# EAGLE design Memory V1.3 (EAGLE 9.7.0)

## Sheet 1 of 6: BUS
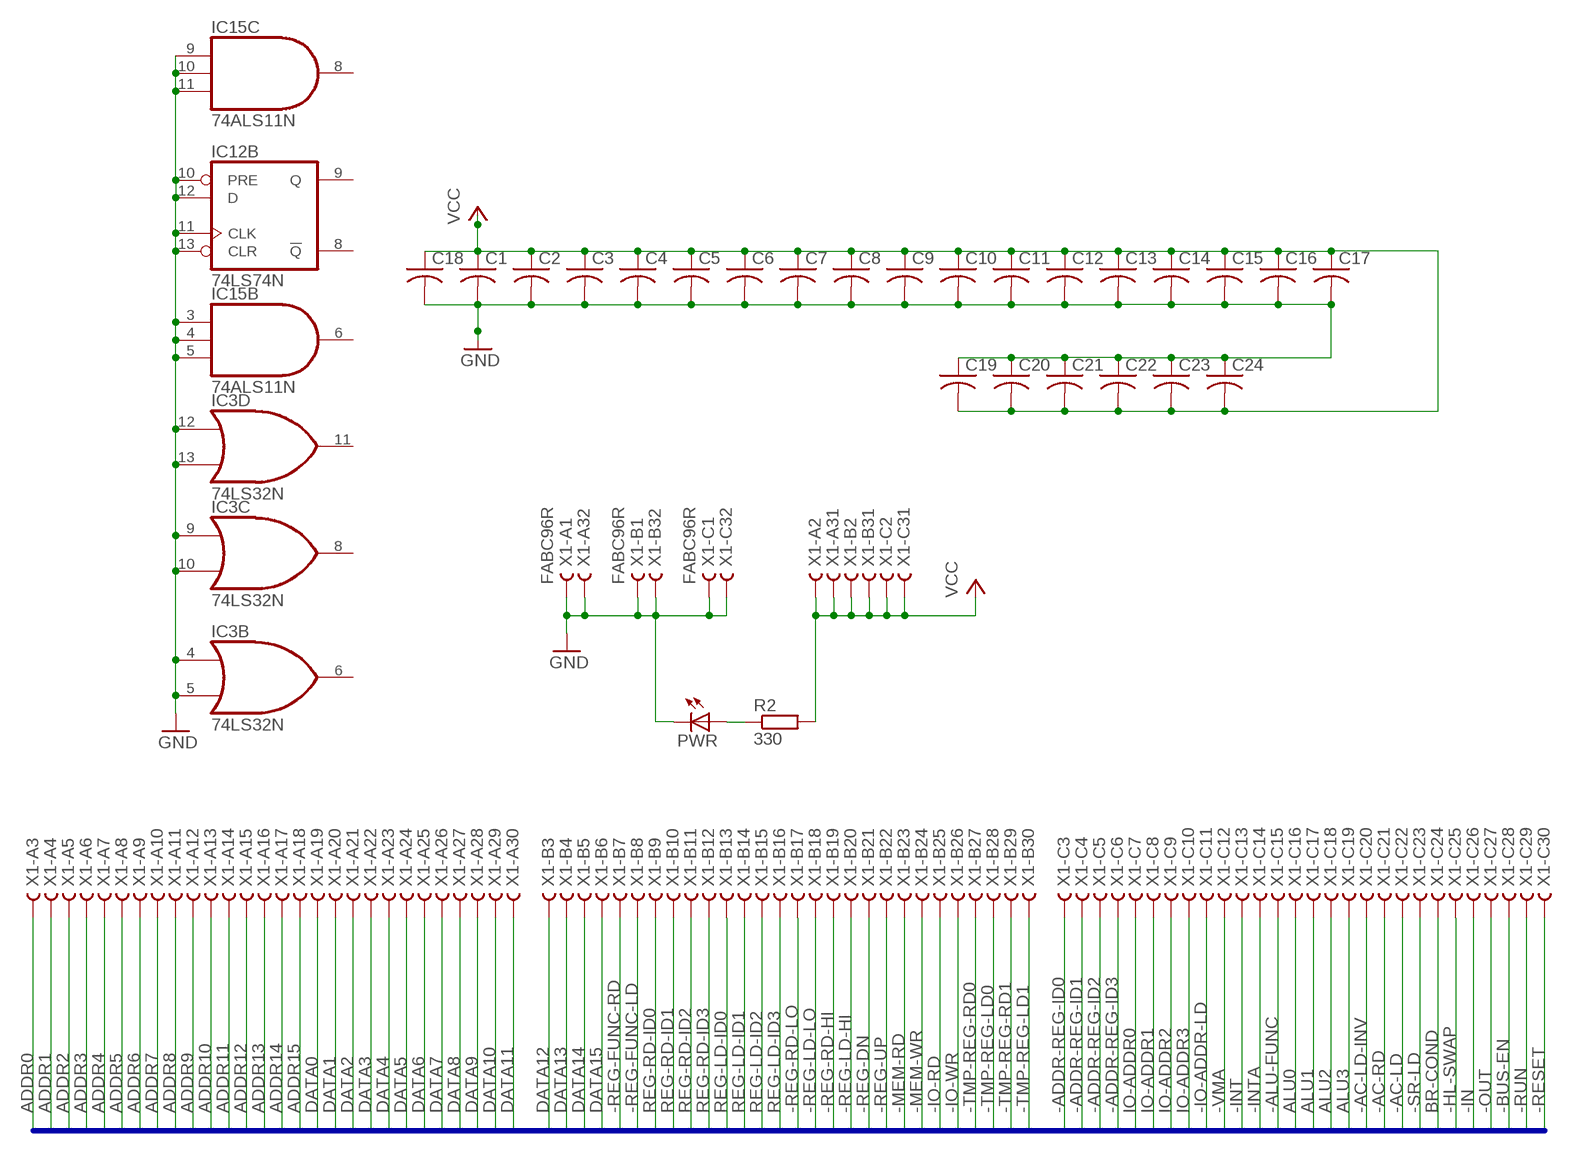
[diagram p0: schematic, sheet 1]

### Parts
C1  C-US025-025X050  [C025-025X050]
C2  C-US025-025X050  [C025-025X050]
C3  C-US025-025X050  [C025-025X050]
C4  C-US025-025X050  [C025-025X050]
C5  C-US025-025X050  [C025-025X050]
C6  C-US025-025X050  [C025-025X050]
C7  C-US025-025X050  [C025-025X050]
C8  C-US025-025X050  [C025-025X050]
C9  C-US025-025X050  [C025-025X050]
C10  C-US025-025X050  [C025-025X050]
C11  C-US025-025X050  [C025-025X050]
C12  C-US025-025X050  [C025-025X050]
C13  C-US025-025X050  [C025-025X050]
C14  C-US025-025X050  [C025-025X050]
C15  C-US025-025X050  [C025-025X050]
C16  C-US025-025X050  [C025-025X050]
C17  C-US025-025X050  [C025-025X050]
C18  C-US025-025X050  [C025-025X050]
C19  C-US025-025X050  [C025-025X050]
C20  C-US025-025X050  [C025-025X050]
C21  C-US025-025X050  [C025-025X050]
C22  C-US025-025X050  [C025-025X050]
C23  C-US025-025X050  [C025-025X050]
C24  C-US025-025X050  [C025-025X050]
IC3  74LS32N  [DIL14]
IC12  74LS74N  [DIL14]
IC15  74ALS11N  [DIL14]
PWR  LED5MM  [LED5MM]
R2  330  R0207/10  [0207/10]
X1  FABC96R  [FABC96R]

### Nets
-AC-LD: X1.C22
-AC-LD-INV: X1.C20
-AC-RD: X1.C21
-ADDR-REG-ID0: X1.C3
-ADDR-REG-ID1: X1.C4
-ADDR-REG-ID2: X1.C5
-ADDR-REG-ID3: X1.C6
-ALU-FUNC: X1.C15
-BUS-EN: X1.C28 ; also sheet 2
-HL-SWAP: X1.C25
-IN: X1.C26
-INT: X1.C13
-INTA: X1.C14
-IO-ADDR-LD: X1.C11
-IO-RD: X1.B25
-IO-WR: X1.B26
-MEM-RD: X1.B23 ; also sheet 3,5
-MEM-WR: X1.B24 ; also sheet 3
-OUT: X1.C27
-REG-DN: X1.B21
-REG-FUNC-LD: X1.B8
-REG-FUNC-RD: X1.B7
-REG-LD-HI: X1.B20
-REG-LD-LO: X1.B18
-REG-RD-HI: X1.B19
-REG-RD-LO: X1.B17
-REG-UP: X1.B22
-RESET: X1.C30 ; also sheet 2
-RUN: X1.C29
-SR-LD: X1.C23
-TMP-REG-LD0: X1.B28 ; also sheet 6
-TMP-REG-LD1: X1.B30 ; also sheet 6
-TMP-REG-RD0: X1.B27 ; also sheet 6
-TMP-REG-RD1: X1.B29 ; also sheet 6
-VMA: X1.C12 ; also sheet 2,3
ADDR0: X1.A3 ; also sheet 4
ADDR1: X1.A4 ; also sheet 4
ADDR2: X1.A5 ; also sheet 4
ADDR3: X1.A6 ; also sheet 4
ADDR4: X1.A7 ; also sheet 4
ADDR5: X1.A8 ; also sheet 4
ADDR6: X1.A9 ; also sheet 4
ADDR7: X1.A10 ; also sheet 4
ADDR8: X1.A11 ; also sheet 4
ADDR9: X1.A12 ; also sheet 4
ADDR10: X1.A13 ; also sheet 4
ADDR11: X1.A14 ; also sheet 4
ADDR12: X1.A15 ; also sheet 4
ADDR13: X1.A16 ; also sheet 4
ADDR14: X1.A17 ; also sheet 4
ADDR15: X1.A18 ; also sheet 2,4
ALU0: X1.C16
ALU1: X1.C17
ALU2: X1.C18
ALU3: X1.C19
BR-COND: X1.C24
DATA0: X1.A19 ; also sheet 5,6
DATA1: X1.A20 ; also sheet 5,6
DATA2: X1.A21 ; also sheet 5,6
DATA3: X1.A22 ; also sheet 5,6
DATA4: X1.A23 ; also sheet 5,6
DATA5: X1.A24 ; also sheet 5,6
DATA6: X1.A25 ; also sheet 5,6
DATA7: X1.A26 ; also sheet 5,6
DATA8: X1.A27 ; also sheet 6
DATA9: X1.A28 ; also sheet 6
DATA10: X1.A29 ; also sheet 6
DATA11: X1.A30 ; also sheet 6
DATA12: X1.B3 ; also sheet 6
DATA13: X1.B4 ; also sheet 6
DATA14: X1.B5 ; also sheet 6
DATA15: X1.B6 ; also sheet 6
GND: C1.2 C2.2 C3.2 C4.2 C5.2 C6.2 C7.2 C8.2 C9.2 C10.2 C11.2 C12.2 C13.2 C14.2 C15.2 C16.2 C17.2 C18.2 C19.1 C20.1 C21.1 C22.1 C23.1 C24.1 IC3.4(B:I0) IC3.5(B:I1) IC3.9(C:I0) IC3.10(C:I1) IC3.12(D:I0) IC3.13(D:I1) IC12.10(B:PRE) IC12.11(B:CLK) IC12.12(B:D) IC12.13(B:CLR) IC15.3(B:I0) IC15.4(B:I1) IC15.5(B:I2) IC15.9(C:I0) IC15.10(C:I1) IC15.11(C:I2) PWR.K(C) X1.A1 X1.A32 X1.B1 X1.B32 X1.C1 X1.C32 ; also sheet 2,3,4,6
IO-ADDR0: X1.C7
IO-ADDR1: X1.C8
IO-ADDR2: X1.C9
IO-ADDR3: X1.C10
N$11: PWR.A R2.1
REG-LD-ID0: X1.B13
REG-LD-ID1: X1.B14
REG-LD-ID2: X1.B15
REG-LD-ID3: X1.B16
REG-RD-ID0: X1.B9
REG-RD-ID1: X1.B10
REG-RD-ID2: X1.B11
REG-RD-ID3: X1.B12
VCC: C1.1 C2.1 C3.1 C4.1 C5.1 C6.1 C7.1 C8.1 C9.1 C10.1 C11.1 C12.1 C13.1 C14.1 C15.1 C16.1 C17.1 C18.1 C19.2 C20.2 C21.2 C22.2 C23.2 C24.2 R2.2 X1.A2 X1.A31 X1.B2 X1.B31 X1.C2 X1.C31 ; also sheet 2,3,4
Unconnected: IC3.6(B:O) IC3.8(C:O) IC3.11(D:O) IC12.8(B:!Q) IC12.9(B:Q) IC15.6(B:O) IC15.8(C:O)

### Buses
MAINBUS:-AC-LD,-AC-LD-INV,-AC-RD,ADDR[0..15],-ADDR-REG-LD[0..1],-ADDR-REG-RD[0..1],ALU[0..3],-ALU-FUNC,BR-COND,-BUS-EN,DATA[0..15],-HL-SWAP,-IN,-INT,-INTA,IO-ADDR[0..3],-IO-ADDR-LD,-IO-RD,-IO-WR,-MEM-RD,-MEM-WR,-OUT,-REG-DN,-REG-FUNC-LD,-REG-FUNC-RD,-REG-LD-HI,REG-LD-ID[0..3],-REG-LD-LO,-REG-RD-HI,REG-RD-ID[0..3],-REG-RD-LO,-REG-UP,-RESET,-RUN,-SR-LD,-TMP-REG-LD[0..1],-TMP-REG-RD[0..1],-VMA

## Sheet 2 of 6: Memory Select
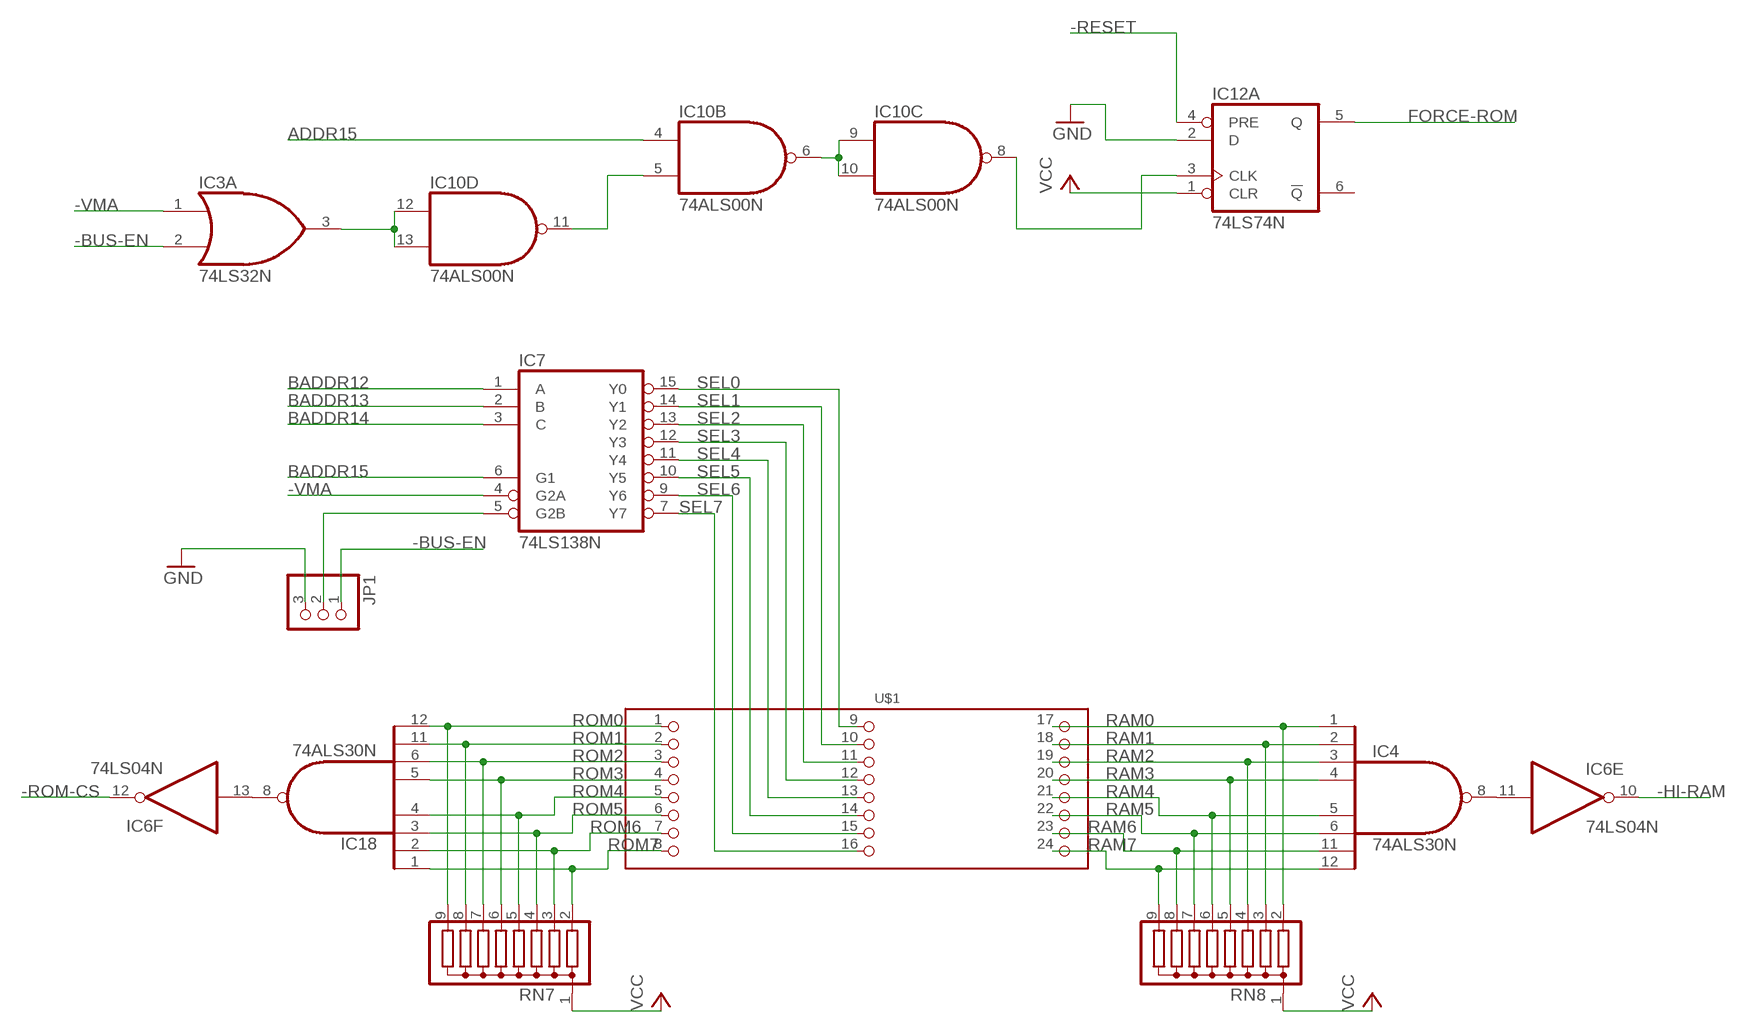
[diagram p1: schematic, sheet 2]

### Parts
IC4  74ALS30N  [DIL14]
IC6  74LS04N  [DIL14]
IC7  74LS138N  [DIL16]
IC10  74ALS00N  [DIL14]
IC18  74ALS30N  [DIL14]
JP1  PINHD-1X3  [1X03]
RN7  G08R  [SIL9]
RN8  G08R  [SIL9]
U$1  PIN_3X8  [PIN_3X8]

### Nets
-BUS-EN: IC3.2(A:I1) JP1.1 ; also sheet 1
-HI-RAM: IC6.10(E:O) ; also sheet 3,5
-RESET: IC12.4(A:PRE) ; also sheet 1
-ROM-CS: IC6.12(F:O) ; also sheet 3,5
-VMA: IC3.1(A:I0) IC7.4(G2A) ; also sheet 1,3
ADDR15: IC10.4(B:I0) ; also sheet 1,4
BADDR12: IC7.1(A) ; also sheet 3,4
BADDR13: IC7.2(B) ; also sheet 3,4
BADDR14: IC7.3(C) ; also sheet 3,4
BADDR15: IC7.6(G1) ; also sheet 3,4
FORCE-ROM: IC12.5(A:Q) ; also sheet 4
GND: IC12.2(A:D) JP1.3 ; also sheet 1,3,4,6
N$1: IC6.13(F:I) IC18.8(O)
N$14: IC4.8(O) IC6.11(E:I)
N$19: IC10.8(C:O) IC12.3(A:CLK)
N$20: IC10.6(B:O) IC10.9(C:I0) IC10.10(C:I1)
N$22: IC10.5(B:I1) IC10.11(D:O)
N$24: IC7.5(G2B) JP1.2
N$25: IC3.3(A:O) IC10.12(D:I0) IC10.13(D:I1)
RAM0: IC4.1(I0) RN8.2 U$1.17
RAM1: IC4.2(I1) RN8.3 U$1.18
RAM2: IC4.3(I2) RN8.4 U$1.19
RAM3: IC4.4(I3) RN8.5 U$1.20
RAM4: IC4.5(I4) RN8.6 U$1.21
RAM5: IC4.6(I5) RN8.7 U$1.22
RAM6: IC4.11(I6) RN8.8 U$1.23
RAM7: IC4.12(I7) RN8.9 U$1.24
ROM0: IC18.12(I7) RN7.9 U$1.1
ROM1: IC18.11(I6) RN7.8 U$1.2
ROM2: IC18.6(I5) RN7.7 U$1.3
ROM3: IC18.5(I4) RN7.6 U$1.4
ROM4: IC18.4(I3) RN7.5 U$1.5
ROM5: IC18.3(I2) RN7.4 U$1.6
ROM6: IC18.2(I1) RN7.3 U$1.7
ROM7: IC18.1(I0) RN7.2 U$1.8
SEL0: IC7.15(Y0) U$1.9
SEL1: IC7.14(Y1) U$1.10
SEL2: IC7.13(Y2) U$1.11
SEL3: IC7.12(Y3) U$1.12
SEL4: IC7.11(Y4) U$1.13
SEL5: IC7.10(Y5) U$1.14
SEL6: IC7.9(Y6) U$1.15
SEL7: IC7.7(Y7) U$1.16
VCC: IC12.1(A:CLR) RN7.1 RN8.1 ; also sheet 1,3,4
Unconnected: IC12.6(A:!Q)

## Sheet 3 of 6: Memory
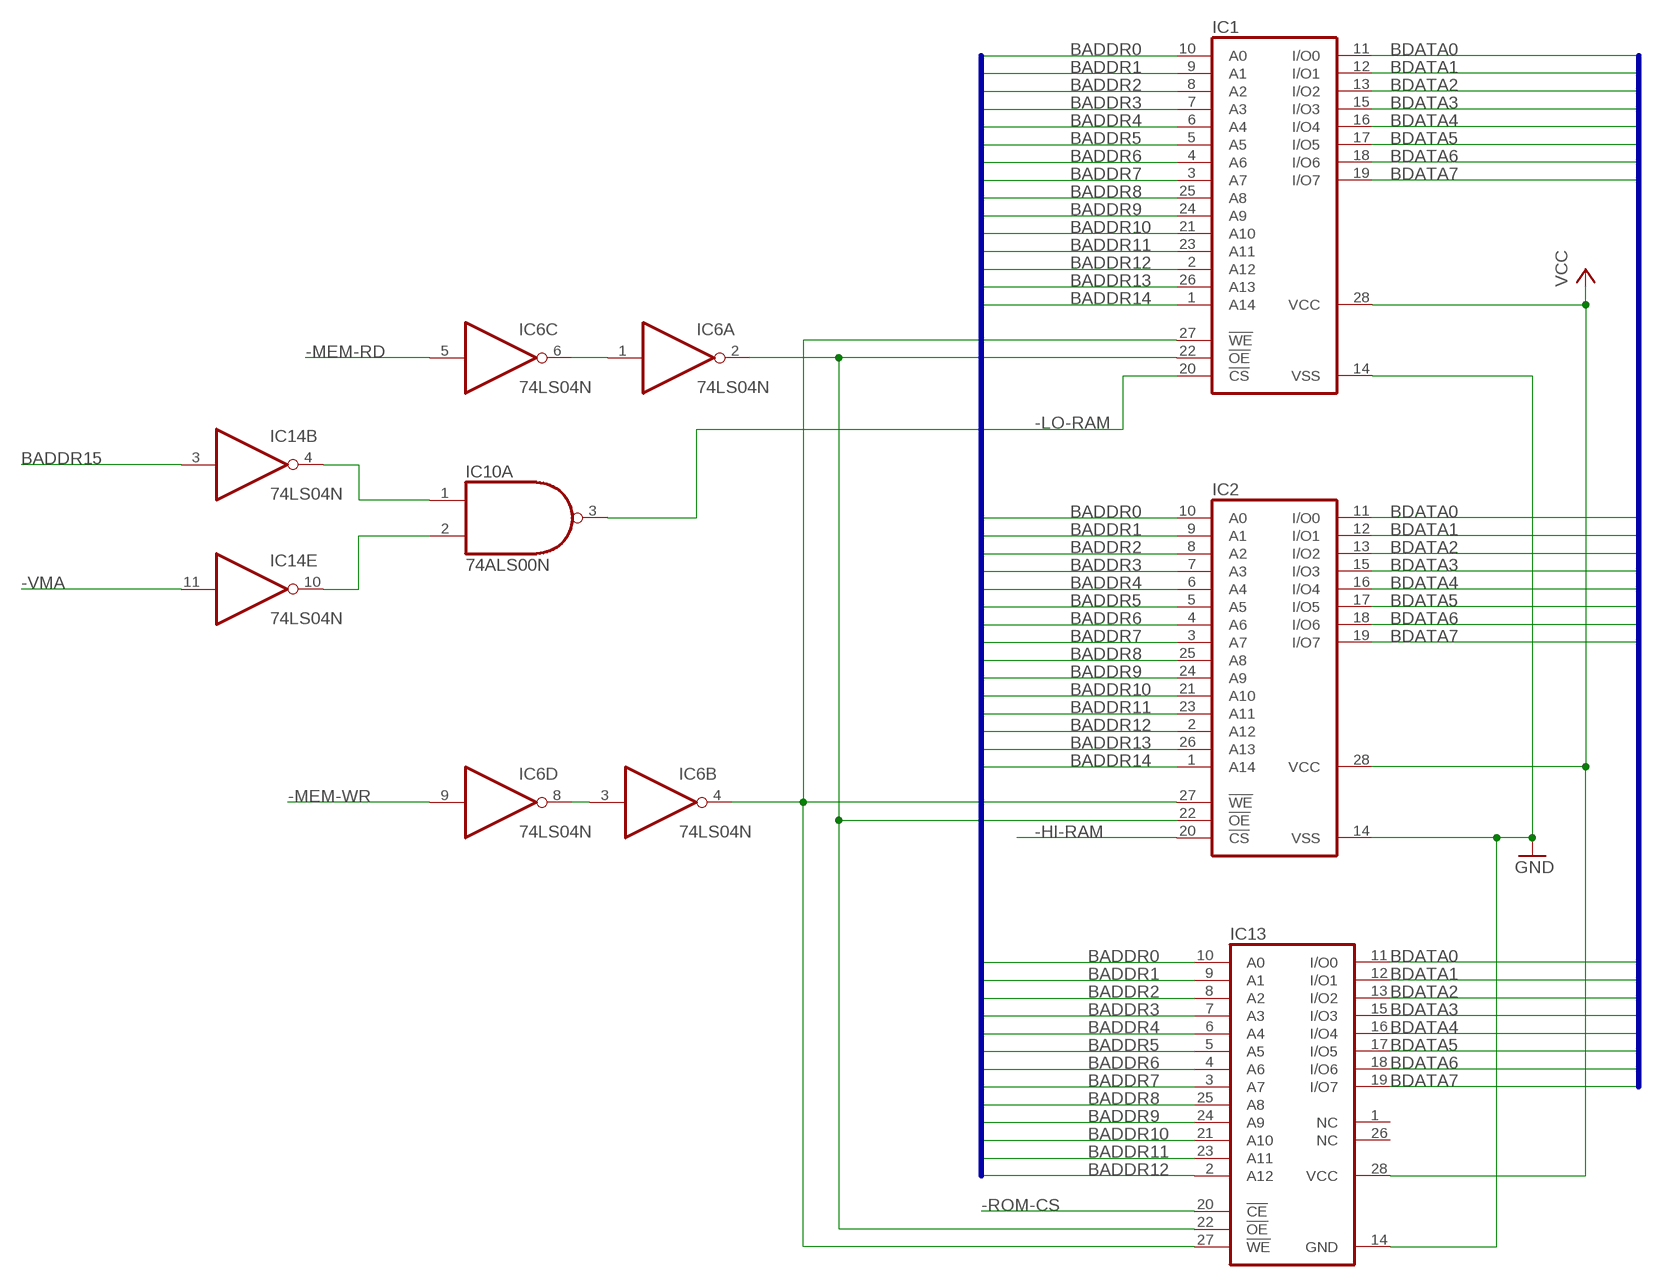
[diagram p2: schematic, sheet 3]

### Parts
IC1  62256P  [DIL28-6]
IC2  62256P  [DIL28-6]
IC13  28C64C  [DIL28-6]
IC14  74LS04N  [DIL14]

### Nets
-HI-RAM: IC2.20(!CS) ; also sheet 2,5
-LO-RAM: IC1.20(!CS) IC10.3(A:O) ; also sheet 5
-MEM-RD: IC6.5(C:I) ; also sheet 1,5
-MEM-WR: IC6.9(D:I) ; also sheet 1
-ROM-CS: IC13.20(!CE) ; also sheet 2,5
-VMA: IC14.11(E:I) ; also sheet 1,2
BADDR0: IC1.10(A0) IC2.10(A0) IC13.10(A0) ; also sheet 4
BADDR1: IC1.9(A1) IC2.9(A1) IC13.9(A1) ; also sheet 4
BADDR2: IC1.8(A2) IC2.8(A2) IC13.8(A2) ; also sheet 4
BADDR3: IC1.7(A3) IC2.7(A3) IC13.7(A3) ; also sheet 4
BADDR4: IC1.6(A4) IC2.6(A4) IC13.6(A4) ; also sheet 4
BADDR5: IC1.5(A5) IC2.5(A5) IC13.5(A5) ; also sheet 4
BADDR6: IC1.4(A6) IC2.4(A6) IC13.4(A6) ; also sheet 4
BADDR7: IC1.3(A7) IC2.3(A7) IC13.3(A7) ; also sheet 4
BADDR8: IC1.25(A8) IC2.25(A8) IC13.25(A8) ; also sheet 4
BADDR9: IC1.24(A9) IC2.24(A9) IC13.24(A9) ; also sheet 4
BADDR10: IC1.21(A10) IC2.21(A10) IC13.21(A10) ; also sheet 4
BADDR11: IC1.23(A11) IC2.23(A11) IC13.23(A11) ; also sheet 4
BADDR12: IC1.2(A12) IC2.2(A12) IC13.2(A12) ; also sheet 2,4
BADDR13: IC1.26(A13) IC2.26(A13) ; also sheet 2,4
BADDR14: IC1.1(A14) IC2.1(A14) ; also sheet 2,4
BADDR15: IC14.3(B:I) ; also sheet 2,4
BDATA0: IC1.11(I/O0) IC2.11(I/O0) IC13.11(I/O0) ; also sheet 5
BDATA1: IC1.12(I/O1) IC2.12(I/O1) IC13.12(I/O1) ; also sheet 5
BDATA2: IC1.13(I/O2) IC2.13(I/O2) IC13.13(I/O2) ; also sheet 5
BDATA3: IC1.15(I/O3) IC2.15(I/O3) IC13.15(I/O3) ; also sheet 5
BDATA4: IC1.16(I/O4) IC2.16(I/O4) IC13.16(I/O4) ; also sheet 5
BDATA5: IC1.17(I/O5) IC2.17(I/O5) IC13.17(I/O5) ; also sheet 5
BDATA6: IC1.18(I/O6) IC2.18(I/O6) IC13.18(I/O6) ; also sheet 5
BDATA7: IC1.19(I/O7) IC2.19(I/O7) IC13.19(I/O7) ; also sheet 5
GND: IC1.14(VSS) IC2.14(VSS) IC13.14(GND) ; also sheet 1,2,4,6
MEM-RD: IC6.1(A:I) IC6.6(C:O)
N$2: IC6.3(B:I) IC6.8(D:O)
N$3: IC1.22(!OE) IC2.22(!OE) IC6.2(A:O) IC13.22(!OE)
N$4: IC1.27(!WE) IC2.27(!WE) IC6.4(B:O) IC13.27(!WE)
N$12: IC10.2(A:I1) IC14.10(E:O)
N$13: IC10.1(A:I0) IC14.4(B:O)
VCC: IC1.28(VCC) IC2.28(VCC) IC13.28(VCC) ; also sheet 1,2,4
Unconnected: IC13.1(NC) IC13.26(NC) IC14.5(C:I) IC14.6(C:O) IC14.8(D:O) IC14.9(D:I)

### Buses
BADDR[0..15]
BDATA[0..7]

## Sheet 4 of 6: Adress Buffering
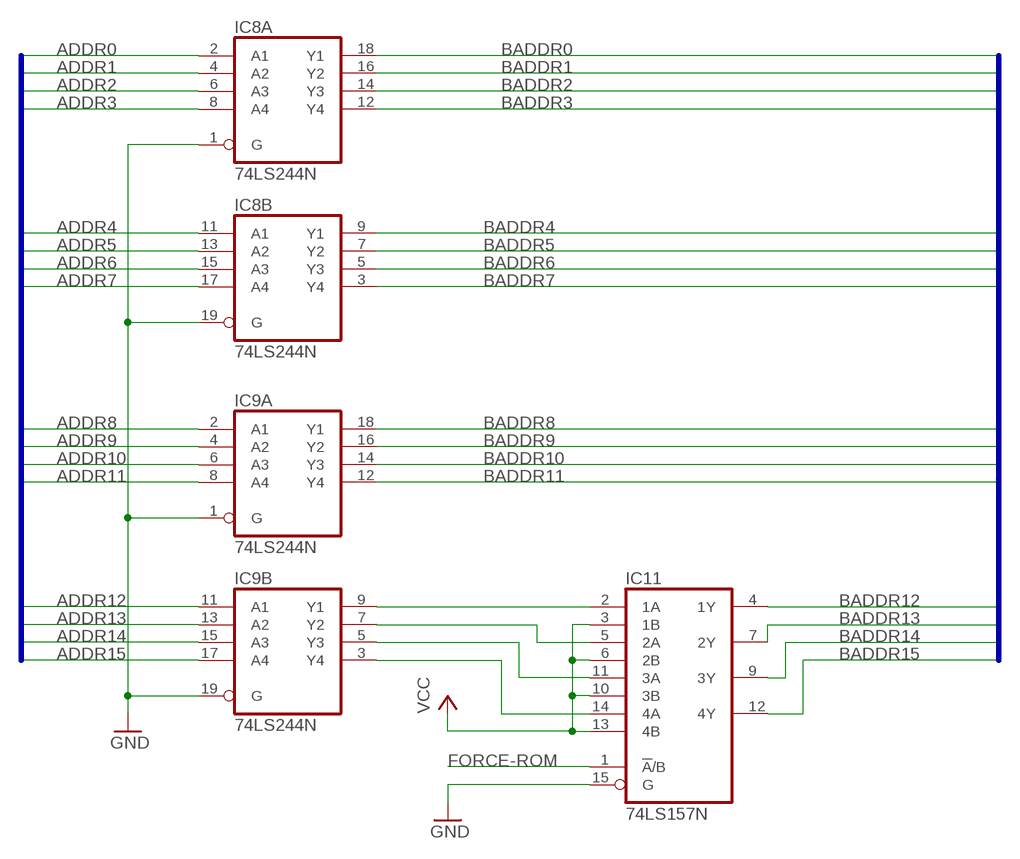
[diagram p3: schematic, sheet 4]

### Parts
IC8  74LS244N  [DIL20]
IC9  74LS244N  [DIL20]
IC11  74LS157N  [DIL16]

### Nets
ADDR0: IC8.2(A:A1) ; also sheet 1
ADDR1: IC8.4(A:A2) ; also sheet 1
ADDR2: IC8.6(A:A3) ; also sheet 1
ADDR3: IC8.8(A:A4) ; also sheet 1
ADDR4: IC8.11(B:A1) ; also sheet 1
ADDR5: IC8.13(B:A2) ; also sheet 1
ADDR6: IC8.15(B:A3) ; also sheet 1
ADDR7: IC8.17(B:A4) ; also sheet 1
ADDR8: IC9.2(A:A1) ; also sheet 1
ADDR9: IC9.4(A:A2) ; also sheet 1
ADDR10: IC9.6(A:A3) ; also sheet 1
ADDR11: IC9.8(A:A4) ; also sheet 1
ADDR12: IC9.11(B:A1) ; also sheet 1
ADDR13: IC9.13(B:A2) ; also sheet 1
ADDR14: IC9.15(B:A3) ; also sheet 1
ADDR15: IC9.17(B:A4) ; also sheet 1,2
BADDR0: IC8.18(A:Y1) ; also sheet 3
BADDR1: IC8.16(A:Y2) ; also sheet 3
BADDR2: IC8.14(A:Y3) ; also sheet 3
BADDR3: IC8.12(A:Y4) ; also sheet 3
BADDR4: IC8.9(B:Y1) ; also sheet 3
BADDR5: IC8.7(B:Y2) ; also sheet 3
BADDR6: IC8.5(B:Y3) ; also sheet 3
BADDR7: IC8.3(B:Y4) ; also sheet 3
BADDR8: IC9.18(A:Y1) ; also sheet 3
BADDR9: IC9.16(A:Y2) ; also sheet 3
BADDR10: IC9.14(A:Y3) ; also sheet 3
BADDR11: IC9.12(A:Y4) ; also sheet 3
BADDR12: IC11.4(1Y) ; also sheet 2,3
BADDR13: IC11.7(2Y) ; also sheet 2,3
BADDR14: IC11.9(3Y) ; also sheet 2,3
BADDR15: IC11.12(4Y) ; also sheet 2,3
FORCE-ROM: IC11.1(!A!/B) ; also sheet 2
GND: IC8.1(A:G) IC8.19(B:G) IC9.1(A:G) IC9.19(B:G) IC11.15(G) ; also sheet 1,2,3,6
N$15: IC9.9(B:Y1) IC11.2(1A)
N$16: IC9.7(B:Y2) IC11.5(2A)
N$17: IC9.5(B:Y3) IC11.11(3A)
N$18: IC9.3(B:Y4) IC11.14(4A)
VCC: IC11.3(1B) IC11.6(2B) IC11.10(3B) IC11.13(4B) ; also sheet 1,2,3

### Buses
ADDR0,ADDR1,ADDR2,ADDR3,ADDR4,ADDR5,ADDR6,ADDR7,ADDR8,ADDR9,ADDR10,ADDR11,ADDR12,ADDR13,ADDR14,ADDR15
BADDR[0..15]

## Sheet 5 of 6: Data Buffer
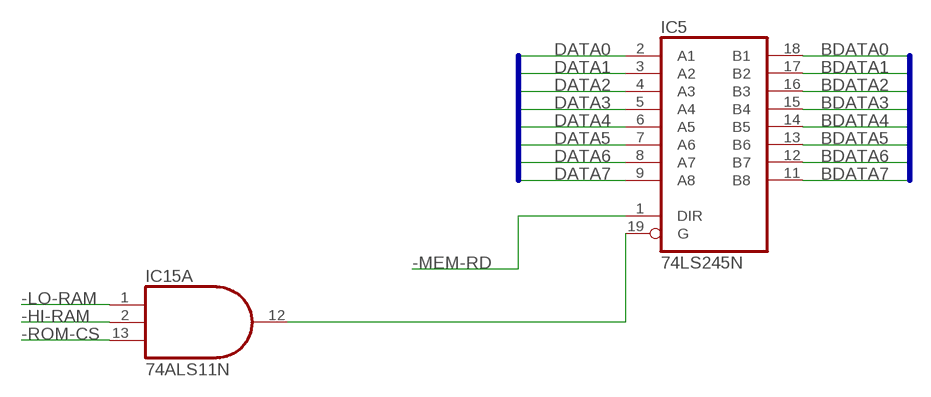
[diagram p4: schematic, sheet 5]

### Parts
IC5  74LS245N  [DIL20]

### Nets
-HI-RAM: IC15.2(A:I1) ; also sheet 2,3
-LO-RAM: IC15.1(A:I0) ; also sheet 3
-MEM-RD: IC5.1(DIR) ; also sheet 1,3
-ROM-CS: IC15.13(A:I2) ; also sheet 2,3
BDATA0: IC5.18(B1) ; also sheet 3
BDATA1: IC5.17(B2) ; also sheet 3
BDATA2: IC5.16(B3) ; also sheet 3
BDATA3: IC5.15(B4) ; also sheet 3
BDATA4: IC5.14(B5) ; also sheet 3
BDATA5: IC5.13(B6) ; also sheet 3
BDATA6: IC5.12(B7) ; also sheet 3
BDATA7: IC5.11(B8) ; also sheet 3
DATA0: IC5.2(A1) ; also sheet 1,6
DATA1: IC5.3(A2) ; also sheet 1,6
DATA2: IC5.4(A3) ; also sheet 1,6
DATA3: IC5.5(A4) ; also sheet 1,6
DATA4: IC5.6(A5) ; also sheet 1,6
DATA5: IC5.7(A6) ; also sheet 1,6
DATA6: IC5.8(A7) ; also sheet 1,6
DATA7: IC5.9(A8) ; also sheet 1,6
N$21: IC5.19(G) IC15.12(A:O)

### Buses
DATA[0..7]
BDATA0,BDATA1,BDATA2,BDATA3,BDATA4,BDATA5,BDATA6,BDATA7

## Sheet 6 of 6
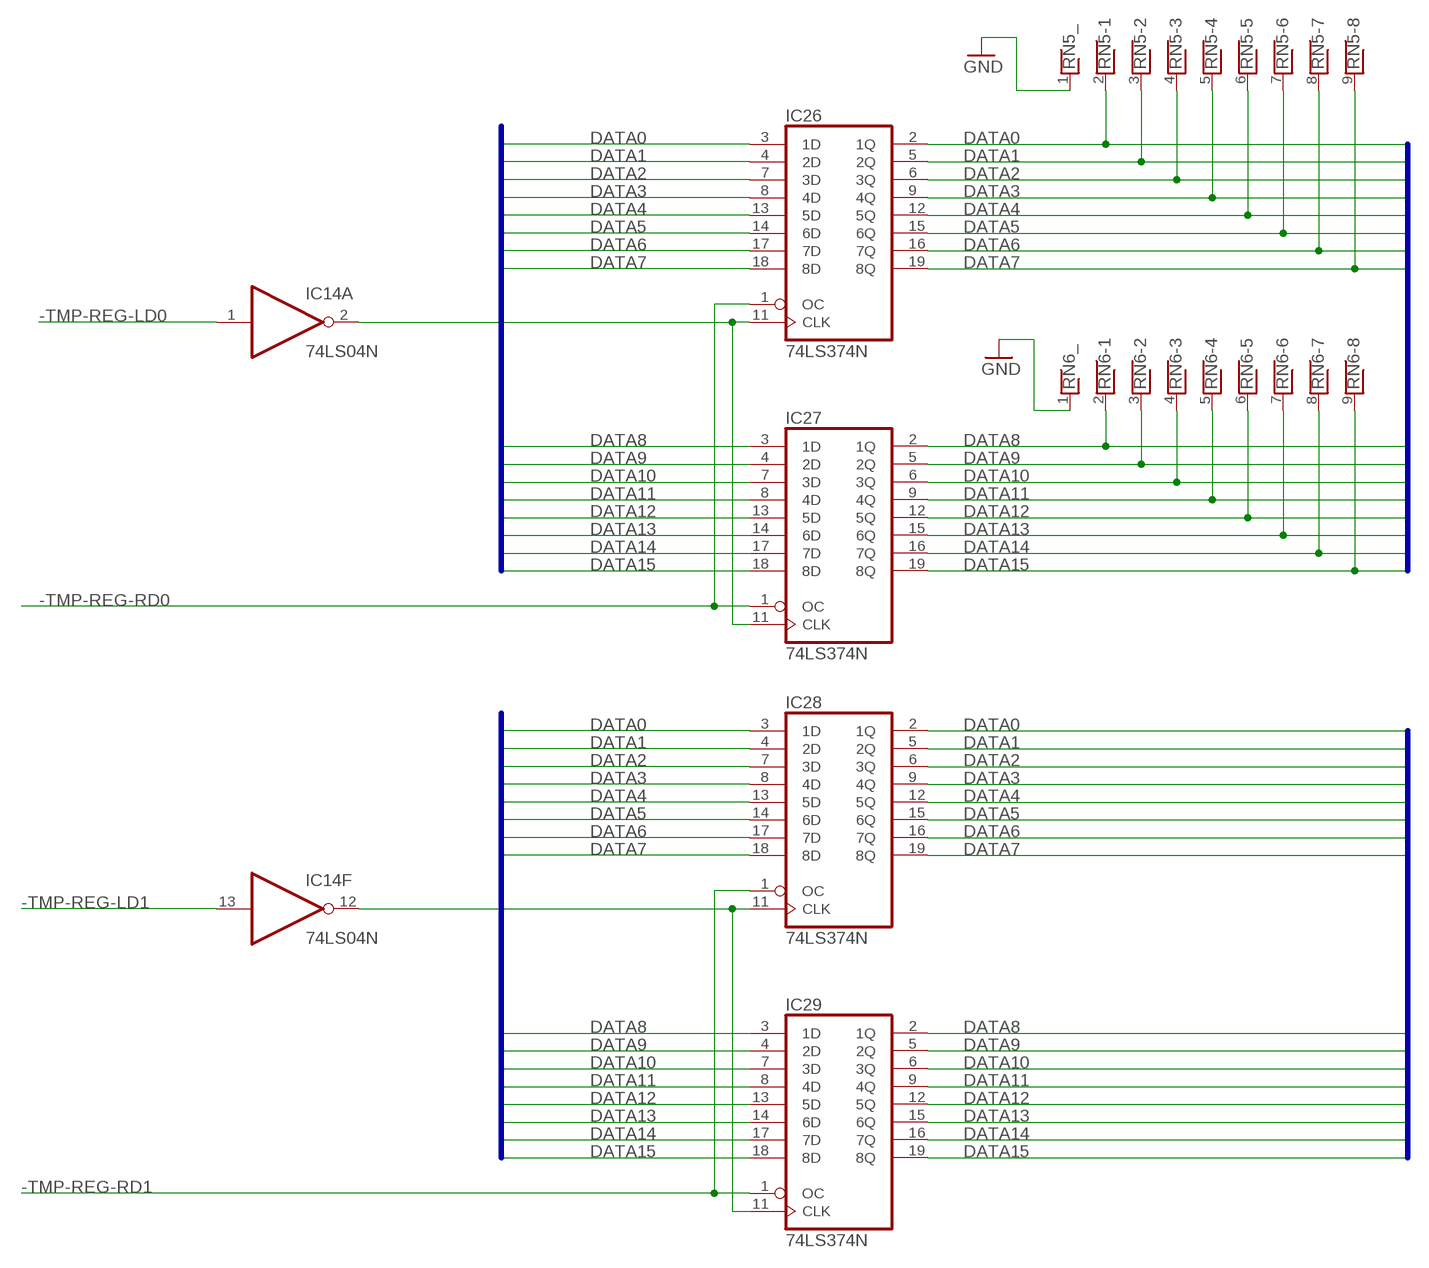
[diagram p5: schematic, sheet 6]

### Parts
IC26  74LS374N  [DIL20]
IC27  74LS374N  [DIL20]
IC28  74LS374N  [DIL20]
IC29  74LS374N  [DIL20]
RN5  RNX8  [RN-9]
RN6  RNX8  [RN-9]

### Nets
-TMP-REG-LD0: IC14.1(A:I) ; also sheet 1
-TMP-REG-LD1: IC14.13(F:I) ; also sheet 1
-TMP-REG-RD0: IC26.1(OC) IC27.1(OC) ; also sheet 1
-TMP-REG-RD1: IC28.1(OC) IC29.1(OC) ; also sheet 1
DATA0: IC26.2(1Q) IC26.3(1D) IC28.2(1Q) IC28.3(1D) RN5.2 ; also sheet 1,5
DATA1: IC26.4(2D) IC26.5(2Q) IC28.4(2D) IC28.5(2Q) RN5.3 ; also sheet 1,5
DATA2: IC26.6(3Q) IC26.7(3D) IC28.6(3Q) IC28.7(3D) RN5.4 ; also sheet 1,5
DATA3: IC26.8(4D) IC26.9(4Q) IC28.8(4D) IC28.9(4Q) RN5.5 ; also sheet 1,5
DATA4: IC26.12(5Q) IC26.13(5D) IC28.12(5Q) IC28.13(5D) RN5.6 ; also sheet 1,5
DATA5: IC26.14(6D) IC26.15(6Q) IC28.14(6D) IC28.15(6Q) RN5.7 ; also sheet 1,5
DATA6: IC26.16(7Q) IC26.17(7D) IC28.16(7Q) IC28.17(7D) RN5.8 ; also sheet 1,5
DATA7: IC26.18(8D) IC26.19(8Q) IC28.18(8D) IC28.19(8Q) RN5.9 ; also sheet 1,5
DATA8: IC27.2(1Q) IC27.3(1D) IC29.2(1Q) IC29.3(1D) RN6.2 ; also sheet 1
DATA9: IC27.4(2D) IC27.5(2Q) IC29.4(2D) IC29.5(2Q) RN6.3 ; also sheet 1
DATA10: IC27.6(3Q) IC27.7(3D) IC29.6(3Q) IC29.7(3D) RN6.4 ; also sheet 1
DATA11: IC27.8(4D) IC27.9(4Q) IC29.8(4D) IC29.9(4Q) RN6.5 ; also sheet 1
DATA12: IC27.12(5Q) IC27.13(5D) IC29.12(5Q) IC29.13(5D) RN6.6 ; also sheet 1
DATA13: IC27.14(6D) IC27.15(6Q) IC29.14(6D) IC29.15(6Q) RN6.7 ; also sheet 1
DATA14: IC27.16(7Q) IC27.17(7D) IC29.16(7Q) IC29.17(7D) RN6.8 ; also sheet 1
DATA15: IC27.18(8D) IC27.19(8Q) IC29.18(8D) IC29.19(8Q) RN6.9 ; also sheet 1
GND: RN5.1 RN6.1 ; also sheet 1,2,3,4
N$33: IC14.2(A:O) IC26.11(CLK) IC27.11(CLK)
N$47: IC14.12(F:O) IC28.11(CLK) IC29.11(CLK)

### Buses
DATABUS:DATA[0..15]

## Power pins joined to a net without a drawn wire
GND: IC3.7(P:GND) IC4.7(GND) IC5.10(GND) IC6.7(P:GND) IC7.8(GND) IC8.10(P:GND) IC9.10(P:GND) IC10.7(P:GND) IC11.8(GND) IC12.7(P:GND) IC14.7(P:GND) IC15.7(P:GND) IC18.7(GND) IC26.10(GND) IC27.10(GND) IC28.10(GND) IC29.10(GND)
VCC: IC3.14(P:VCC) IC4.14(VCC) IC5.20(VCC) IC6.14(P:VCC) IC7.16(VCC) IC8.20(P:VCC) IC9.20(P:VCC) IC10.14(P:VCC) IC11.16(VCC) IC12.14(P:VCC) IC14.14(P:VCC) IC15.14(P:VCC) IC18.14(VCC) IC26.20(VCC) IC27.20(VCC) IC28.20(VCC) IC29.20(VCC)

## Library data of the parts
C1-C24 = adafruit:C-US: CAPACITOR, American symbol
IC1 IC2 = memory-hitachi:62256P: MEMORY; OC_FARNELL: unknown; OC_NEWARK: unknown
IC3 = 74xx-us:74*32: Quad 2-input OR gate
IC4 IC18 = 74xx-us:74*30: 8-input NAND gate
IC5 = adafruit:74*245: Octal BUS TRANSCEIVER, 3-state
IC6 IC14 = 74xx-us:74*04: Hex INVERTER
IC7 = 74xx-us:74*138: 3-line to 8-line DECODER/DEMULTIPLEXER
IC8 IC9 = 74xx-us:74*244: Octal BUFFER and LINE DRIVER, 3-state
IC10 = 74xx-us:74*00: Quad 2-input NAND gate
IC11 = 74xx-us:74*157: Quadruple 2-line to 1-line data SELECTOR/MULTIPLEXER
IC12 = 74xx-us:74*74: Dual D type positive edge triggered FLIP FLOP, preset and clear
IC13 = memory-nec:28C64C: MEMORY; MPN: AT28C64B-15PU; OC_FARNELL: 1095784; OC_NEWARK: 96K6557
IC15 = 74xx-us:74*11: Triple 3-input AND gate
IC26-IC29 = 74xx-us:74*374: Octal D type transparent LATCH, edge triggered
JP1 = pinhead:PINHD-1X3: PIN HEADER
PWR = led:LED: LED OSRAM: - CHIPLED LG R971, LG N971, LY N971, LG Q971, LY Q971, LO R971, LY R971 LH N974, LH R974 LS Q976, LO Q976, LY Q976 LO Q996 - Hyper CHIPLED LW Q18S LB Q993, LB Q99A, LB R99A - SideLED LS A670, LO A670, LY A670, LG A670, LP A670 LB A673, LV A673, LT A673, LW A673 LH A674 LY A675 LS A676, LA A676, LO A676, LY A676, LW A676 LS A679, LY A679, LG A679 - Hyper Micro SIDELED® LS Y876, LA Y876, LO Y876, LY Y876 LT Y87S - SmartLED LW L88C, LW L88S LB L89C, LB L89S, LG L890 LS L89K, LO L89K, LY L89K LS L896, LA L896, LO L896, LY L896 - TOPLED LS T670, LO T670, LY T670, LG T670, LP T670 LSG T670, LSP T670, LSY T670, LOP T670, LYG T670 LG T671, LOG T671, LSG T671 LB T673, LV T673, LT T673, LW T673 LH T674 LS T676, LA T676, LO T676, LY T676, LB T676, LH T676, LSB T676, LW T676 LB T67C, LV T67C, LT T67C, LS T67K, LO T67K, LY T67K, LW E67C LS E67B, LA E67B, LO E67B, LY E67B, LB E67C, LV E67C, LT E67C LW T67C LS T679, LY T679, LG T679 LS T770, LO T770, LY T770, LG T770, LP T770 LB T773, LV T773, LT T773, LW T773 LH T774 LS E675, LA E675, LY E675, LS T675 LS T776, LA T776, LO T776, LY T776, LB T776 LHGB T686 LT T68C, LB T68C - Hyper Mini TOPLED® LB M676 - Mini TOPLED Santana® LG M470 LS M47K, LO M47K, LY M47K Source: http://www.osram.convergy.de LUXEON: - LUMILED® LXK2-PW12-R00, LXK2-PW12-S00, LXK2-PW14-U00, LXK2-PW14-V00 LXK2-PM12-R00, LXK2-PM12-S00, LXK2-PM14-U00 LXK2-PE12-Q00, LXK2-PE12-R00, LXK2-PE12-S00, LXK2-PE14-T00, LXK2-PE14-U00 LXK2-PB12-K00, LXK2-PB12-L00, LXK2-PB12-M00, LXK2-PB14-N00, LXK2-PB14-P00, LXK2-PB14-Q00 LXK2-PR12-L00, LXK2-PR12-M00, LXK2-PR14-Q00, LXK2-PR14-R00 LXK2-PD12-Q00, LXK2-PD12-R00, LXK2-PD12-S00 LXK2-PH12-R00, LXK2-PH12-S00 LXK2-PL12-P00, LXK2-PL12-Q00, LXK2-PL12-R00 Source: www.luxeon.com KINGBRIGHT: KA-3528ASYC Source: www.kingbright.com
R2 = eagle-ltspice:R: RESISTOR, European symbol; SPICEMODEL: NONE; SPICEPREFIX: R
RN5 RN6 = resistor-net:RNX8: RESISTOR NETWORK; OC_FARNELL: unknown; OC_NEWARK: unknown
RN7 RN8 = resistor-sil:G08R: SIL RESISTOR; OC_FARNELL: unknown; OC_NEWARK: unknown
U$1 = pinhead_3row:PIN_3X8
X1 = con-vg:FABC96R: CONNECTOR female, 96 pins, type R, rows ABC, grid 2.54 mm

## Net classes
1 GND: width 1 mm
2 5V: width 1 mm

## Board
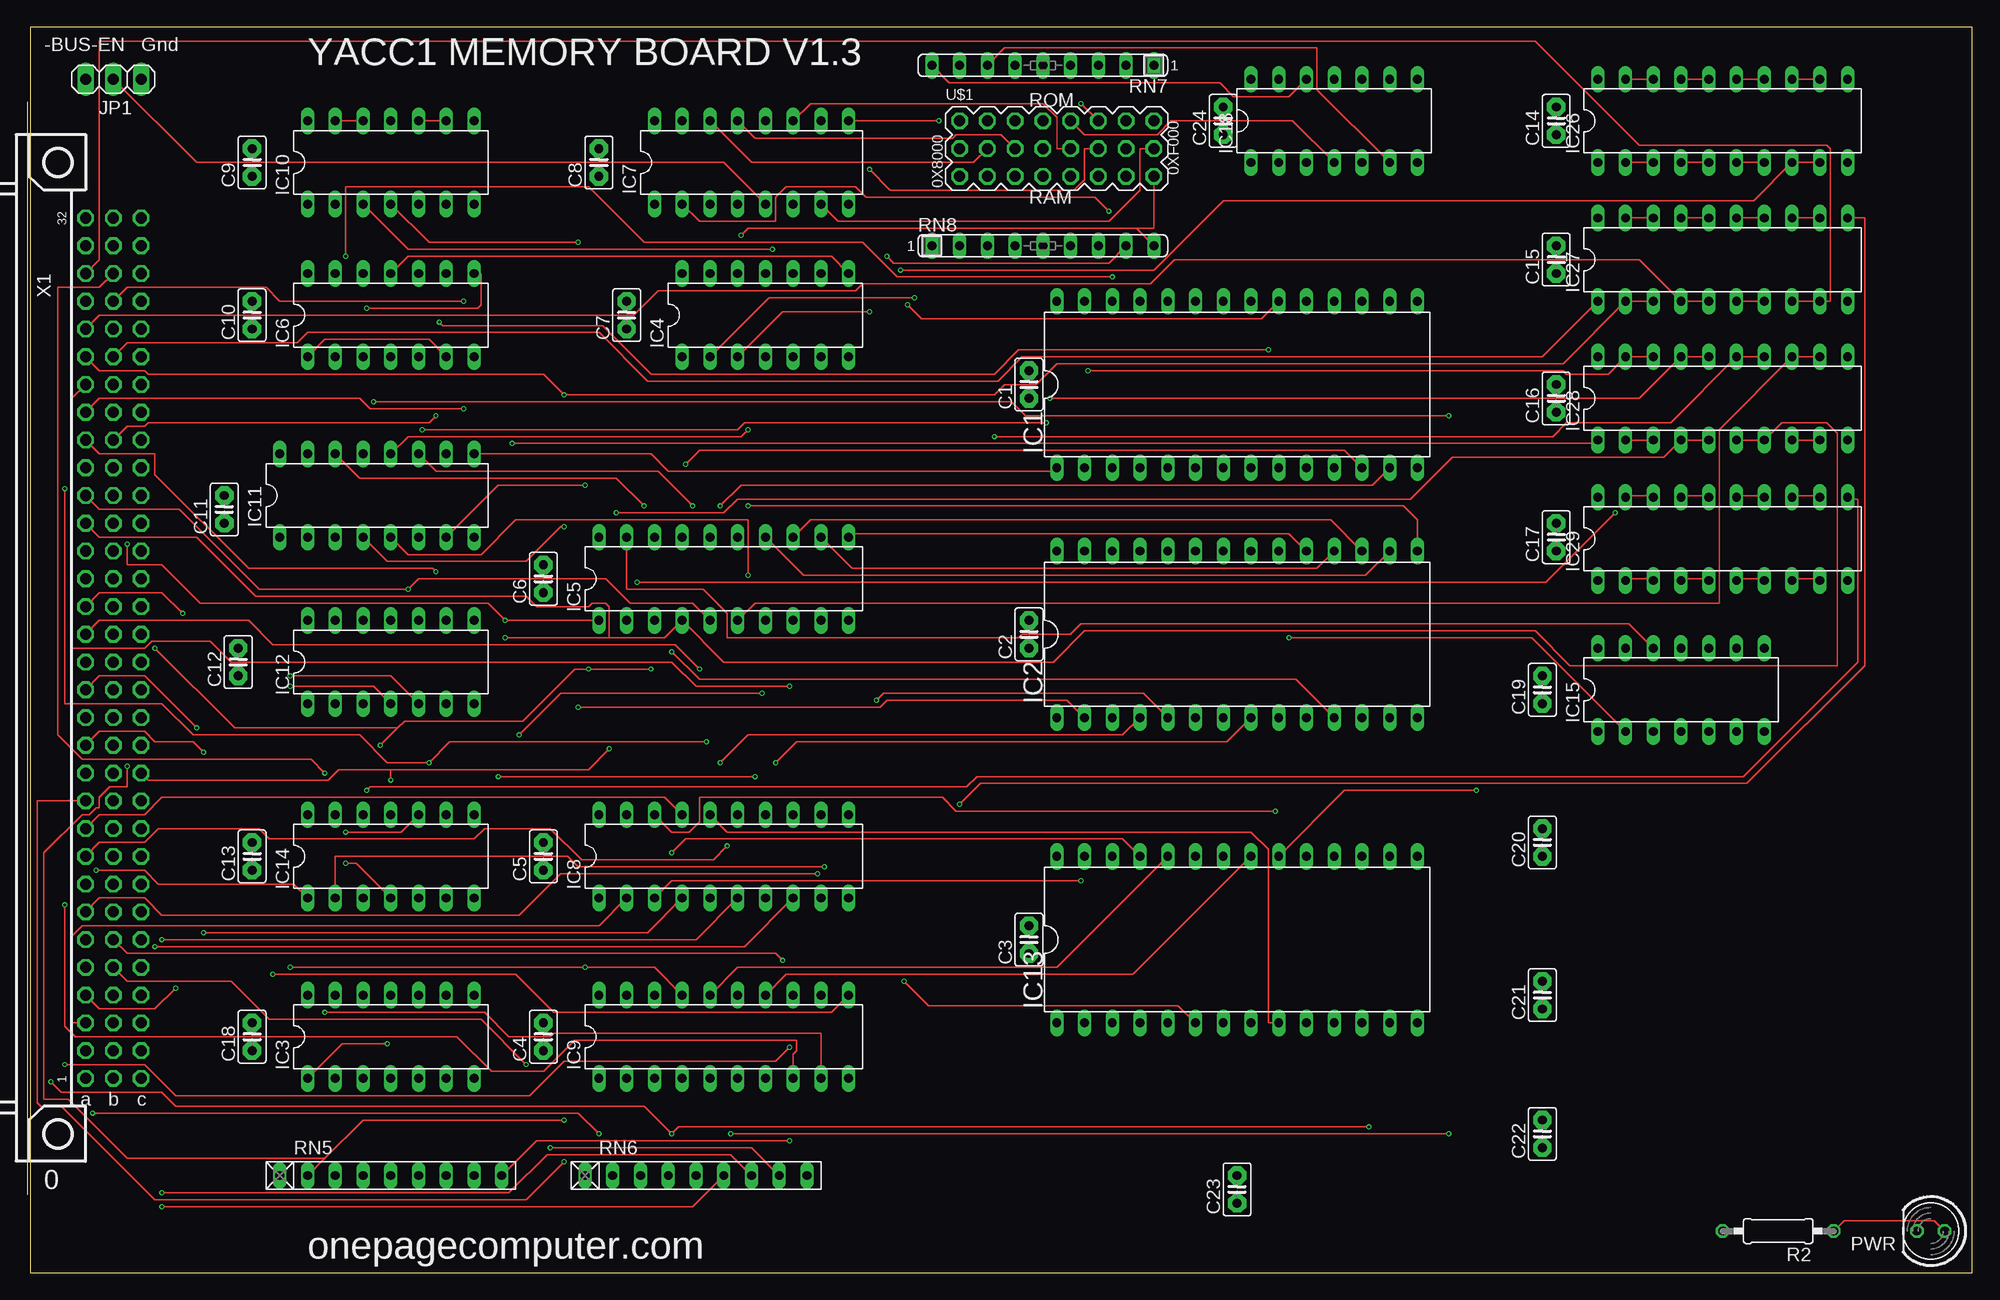
[diagram p6: board, top side]
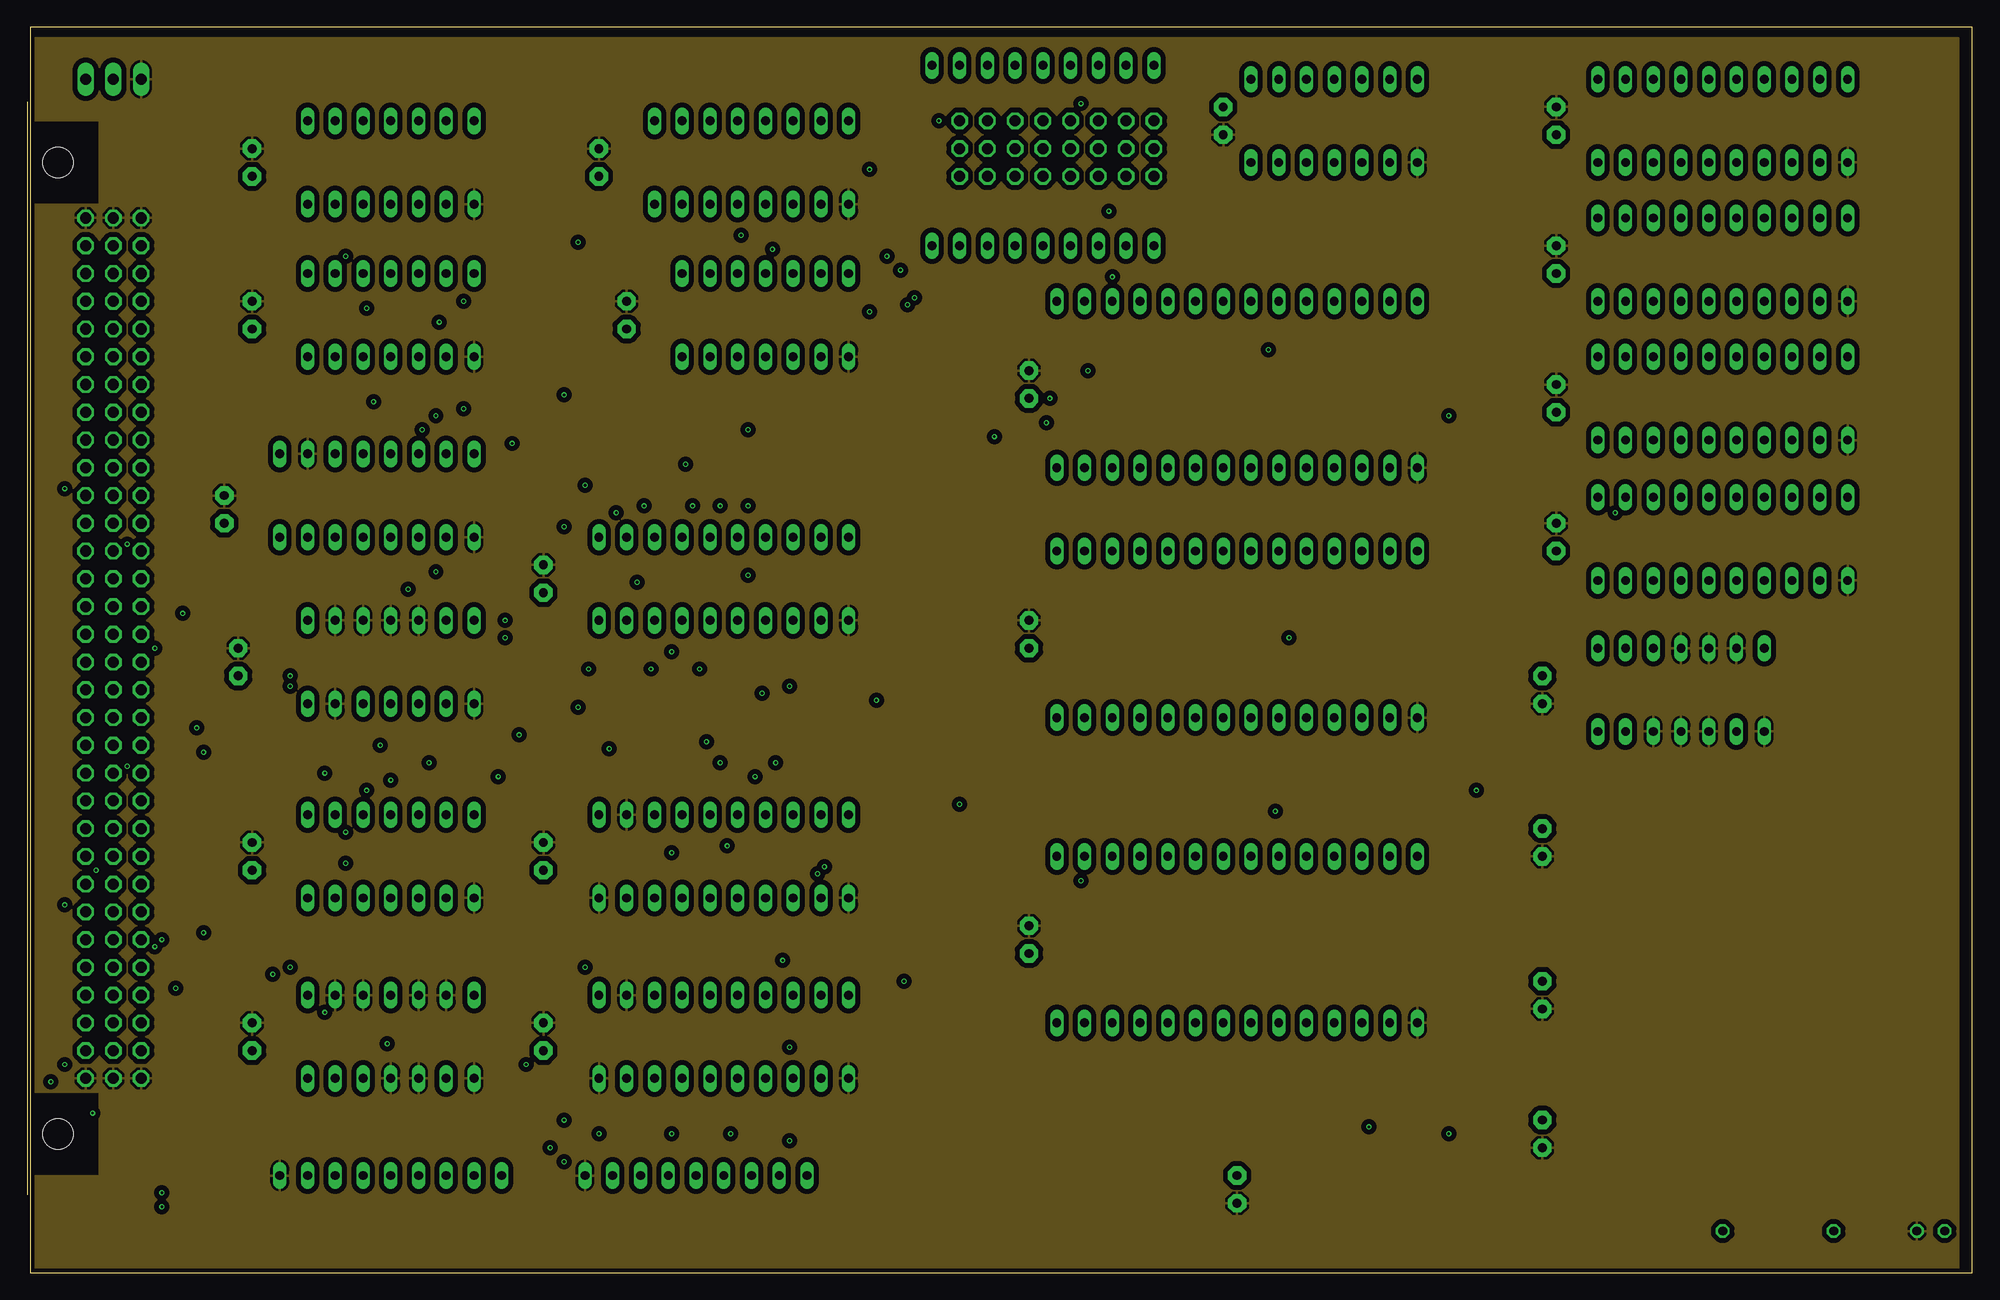
[diagram p7: board, inner layer Route2]
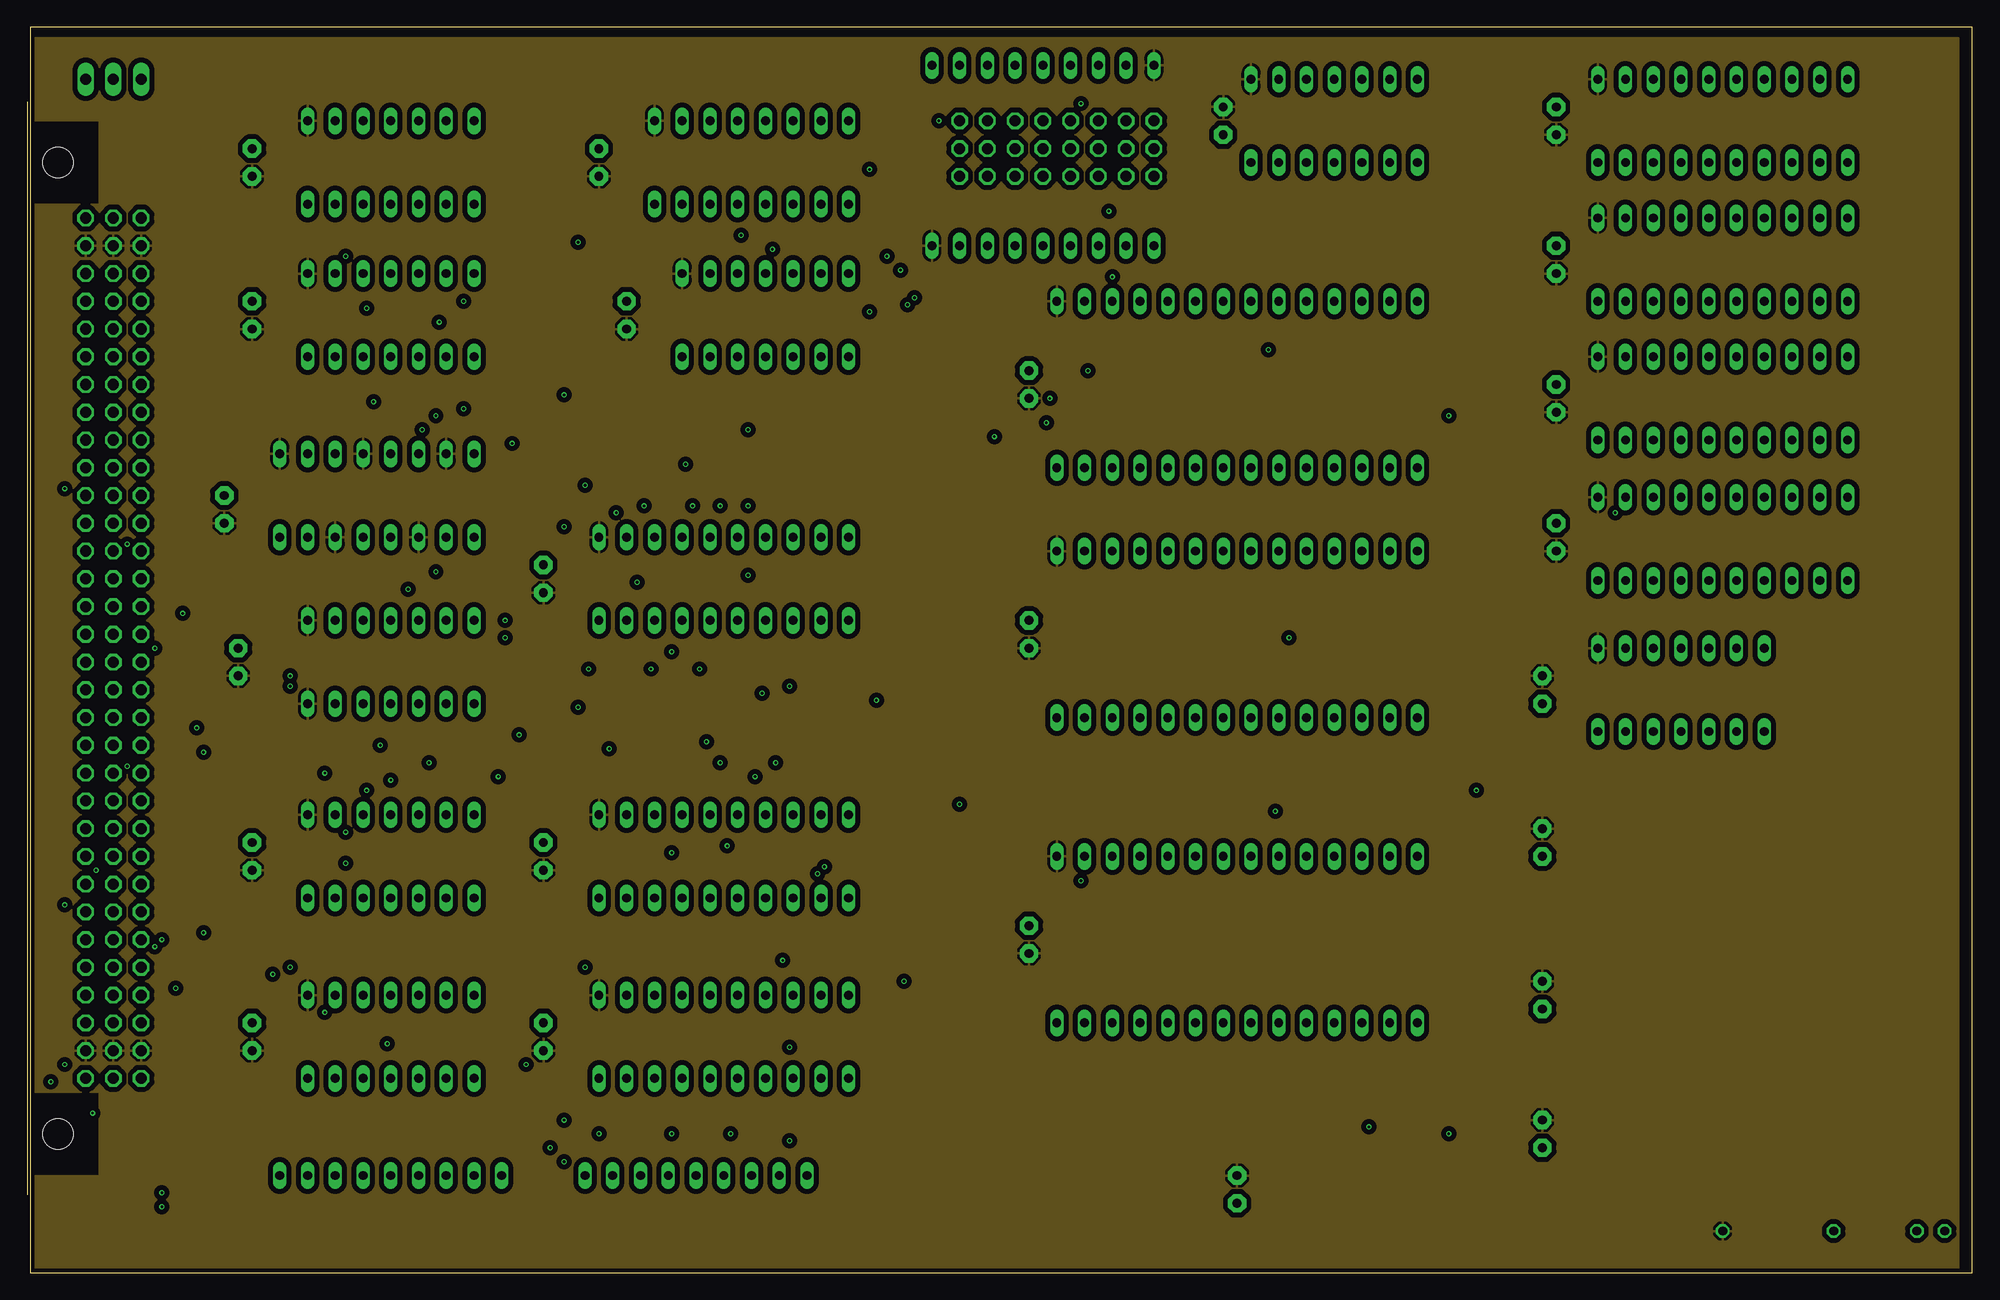
[diagram p8: board, inner layer Route15]
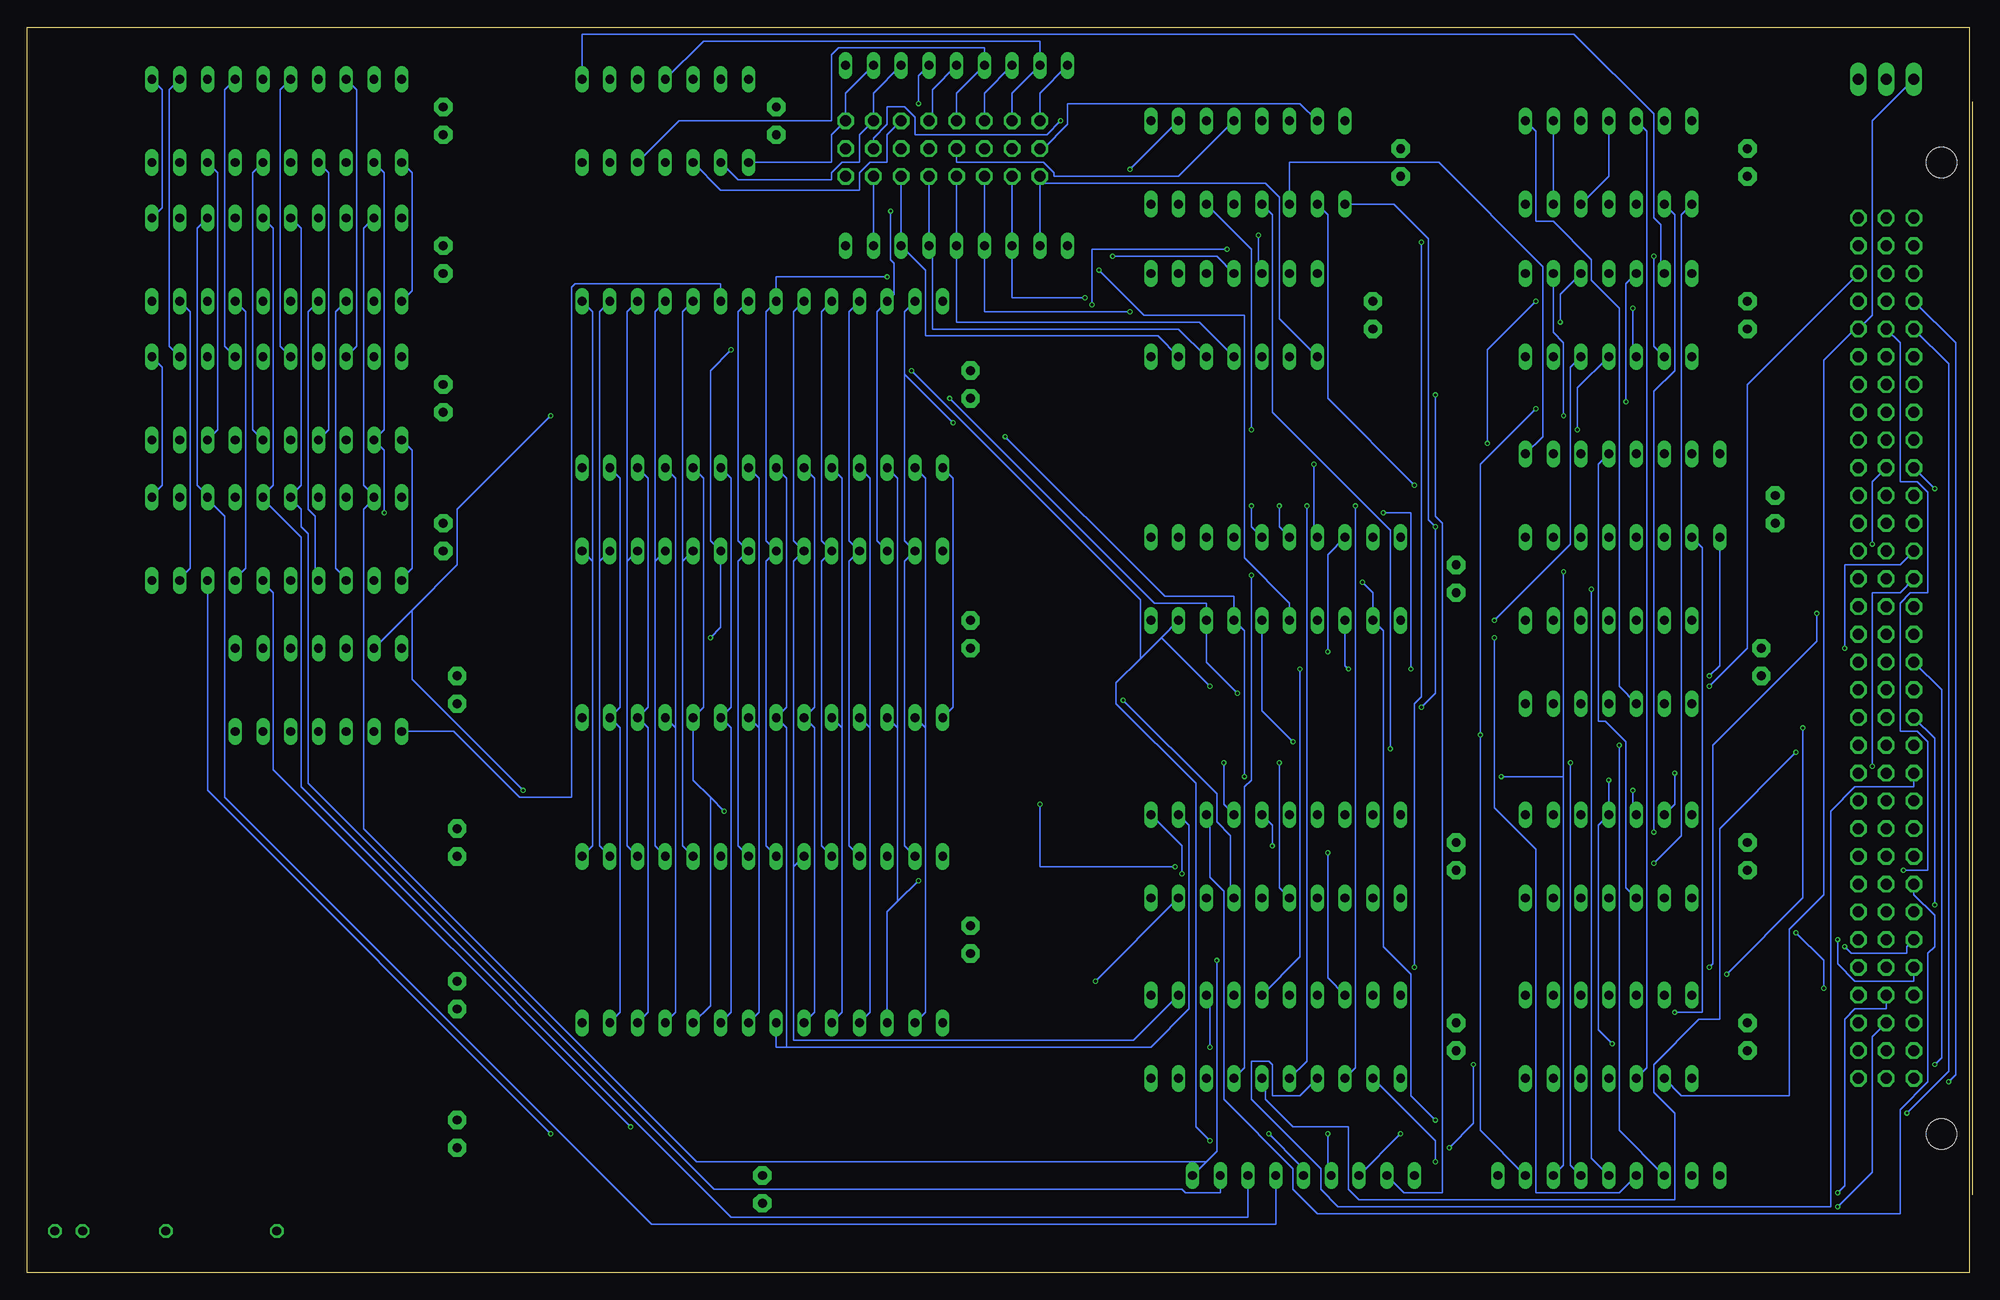
[diagram p9: board, bottom side, seen from below]

Size 177.78 x 113.97 mm. Coordinates in mm from the lower left corner, seen from the top.
Outline: 0,0 177.78,0 177.78,113.97 0,113.97 0,0
Copper layers (1*2*15*16): Top 0.035559375mm / dielectric 0.17018125mm / Route2 0.01778125mm / dielectric 47mil / Route15 0.01778125mm / dielectric 0.17018125mm / Bottom 0.035559375mm
Design rules "oshpark-4layer *": minimum track width 6mil, minimum drill 10mil, track to track 18mil, track to pad 10mil, pad to pad 5mil, via to via 5mil, smd to smd 5mil, copper to edge 15mil, drill to drill 6mil, minimum pad ring 4mil, minimum via ring 4mil, stop-mask expansion 2.5mil, vias tented up to drill 0mil, thermal gap 10mil

### Footprints (pad centres in the part's own frame; a part is rotated, then mirrored left to right if it is on the bottom)
C025-025X050 = drill 0.813 pad 1.676 octagon: 1 -1.27,0; 2 1.27,0
DIL28-6 = drill 0.813 long: 1 -16.51,-7.62; 2 -13.97,-7.62; 3 -11.43,-7.62; 4 -8.89,-7.62; 5 -6.35,-7.62; 6 -3.81,-7.62; 7 -1.27,-7.62; 8 1.27,-7.62; 9 3.81,-7.62; 10 6.35,-7.62; 11 8.89,-7.62; 12 11.43,-7.62; 13 13.97,-7.62; 14 16.51,-7.62; 15 16.51,7.62; 16 13.97,7.62; 17 11.43,7.62; 18 8.89,7.62; 19 6.35,7.62; 20 3.81,7.62; 21 1.27,7.62; 22 -1.27,7.62; 23 -3.81,7.62; 24 -6.35,7.62; 25 -8.89,7.62; 26 -11.43,7.62; 27 -13.97,7.62; 28 -16.51,7.62
DIL14 = drill 0.813 long: 1 -7.62,-3.81; 2 -5.08,-3.81; 3 -2.54,-3.81; 4 0,-3.81; 5 2.54,-3.81; 6 5.08,-3.81; 7 7.62,-3.81; 8 7.62,3.81; 9 5.08,3.81; 10 2.54,3.81; 11 0,3.81; 12 -2.54,3.81; 13 -5.08,3.81; 14 -7.62,3.81
DIL20 = drill 0.813 long: 1 -11.43,-3.81; 2 -8.89,-3.81; 3 -6.35,-3.81; 4 -3.81,-3.81; 5 -1.27,-3.81; 6 1.27,-3.81; 7 3.81,-3.81; 8 6.35,-3.81; 9 8.89,-3.81; 10 11.43,-3.81; 11 11.43,3.81; 12 8.89,3.81; 13 6.35,3.81; 14 3.81,3.81; 15 1.27,3.81; 16 -1.27,3.81; 17 -3.81,3.81; 18 -6.35,3.81; 19 -8.89,3.81; 20 -11.43,3.81
DIL16 = drill 0.813 long: 1 -8.89,-3.81; 2 -6.35,-3.81; 3 -3.81,-3.81; 4 -1.27,-3.81; 5 1.27,-3.81; 6 3.81,-3.81; 7 6.35,-3.81; 8 8.89,-3.81; 9 8.89,3.81; 10 6.35,3.81; 11 3.81,3.81; 12 1.27,3.81; 13 -1.27,3.81; 14 -3.81,3.81; 15 -6.35,3.81; 16 -8.89,3.81
1X03 = drill 1.016 long: 1 -2.54,0; 2 0,0; 3 2.54,0
LED5MM = drill 0.813 octagon: A -1.27,0; K 1.27,0
0207/10 = drill 0.813 octagon: 1 -5.08,0; 2 5.08,0
RN-9 = drill 0.813 long: 1 -10.16,0; 2 -7.62,0; 3 -5.08,0; 4 -2.54,0; 5 0,0; 6 2.54,0; 7 5.08,0; 8 7.62,0; 9 10.16,0
SIL9 = drill 0.813 long: 1 -10.16,0; 2 -7.62,0; 3 -5.08,0; 4 -2.54,0; 5 0,0; 6 2.54,0; 7 5.08,0; 8 7.62,0; 9 10.16,0
PIN_3X8 = drill 1.016 octagon: 1 1.27,-1.27; 2 3.81,-1.27; 3 6.35,-1.27; 4 8.89,-1.27; 5 11.43,-1.27; 6 13.97,-1.27; 7 16.51,-1.27; 8 19.05,-1.27; 9 1.27,-3.81; 10 3.81,-3.81; 11 6.35,-3.81; 12 8.89,-3.81; 13 11.43,-3.81; 14 13.97,-3.81; 15 16.51,-3.81; 16 19.05,-3.81; 17 1.27,-6.35; 18 3.81,-6.35; 19 6.35,-6.35; 20 8.89,-6.35; 21 11.43,-6.35; 22 13.97,-6.35; 23 16.51,-6.35; 24 19.05,-6.35
FABC96R = drill 1.016 octagon: A1 -2.54,39.37; A2 -2.54,36.83; A3 -2.54,34.29; A4 -2.54,31.75; A5 -2.54,29.21; A6 -2.54,26.67; A7 -2.54,24.13; A8 -2.54,21.59; A9 -2.54,19.05; A10 -2.54,16.51; A11 -2.54,13.97; A12 -2.54,11.43; A13 -2.54,8.89; A14 -2.54,6.35; A15 -2.54,3.81; A16 -2.54,1.27; A17 -2.54,-1.27; A18 -2.54,-3.81; A19 -2.54,-6.35; A20 -2.54,-8.89; A21 -2.54,-11.43; A22 -2.54,-13.97; A23 -2.54,-16.51; A24 -2.54,-19.05; A25 -2.54,-21.59; A26 -2.54,-24.13; A27 -2.54,-26.67; A28 -2.54,-29.21; A29 -2.54,-31.75; A30 -2.54,-34.29; A31 -2.54,-36.83; A32 -2.54,-39.37; B1 -5.08,39.37; B2 -5.08,36.83; B3 -5.08,34.29; B4 -5.08,31.75; B5 -5.08,29.21; B6 -5.08,26.67; B7 -5.08,24.13; B8 -5.08,21.59; B9 -5.08,19.05; B10 -5.08,16.51; B11 -5.08,13.97; B12 -5.08,11.43; B13 -5.08,8.89; B14 -5.08,6.35; B15 -5.08,3.81; B16 -5.08,1.27; B17 -5.08,-1.27; B18 -5.08,-3.81; B19 -5.08,-6.35; B20 -5.08,-8.89; B21 -5.08,-11.43; B22 -5.08,-13.97; B23 -5.08,-16.51; B24 -5.08,-19.05; B25 -5.08,-21.59; B26 -5.08,-24.13; B27 -5.08,-26.67; B28 -5.08,-29.21; B29 -5.08,-31.75; B30 -5.08,-34.29; B31 -5.08,-36.83; B32 -5.08,-39.37; C1 -7.62,39.37; C2 -7.62,36.83; C3 -7.62,34.29; C4 -7.62,31.75; C5 -7.62,29.21; C6 -7.62,26.67; C7 -7.62,24.13; C8 -7.62,21.59; C9 -7.62,19.05; C10 -7.62,16.51; C11 -7.62,13.97; C12 -7.62,11.43; C13 -7.62,8.89; C14 -7.62,6.35; C15 -7.62,3.81; C16 -7.62,1.27; C17 -7.62,-1.27; C18 -7.62,-3.81; C19 -7.62,-6.35; C20 -7.62,-8.89; C21 -7.62,-11.43; C22 -7.62,-13.97; C23 -7.62,-16.51; C24 -7.62,-19.05; C25 -7.62,-21.59; C26 -7.62,-24.13; C27 -7.62,-26.67; C28 -7.62,-29.21; C29 -7.62,-31.75; C30 -7.62,-34.29; C31 -7.62,-36.83; C32 -7.62,-39.37 | hole 2.794: 0,-44.456; 0,44.456

### Placement (x,y rotation side)
C1  91.44,81.28 90 top
C2  91.44,58.42 90 top
C3  91.44,30.48 90 top
C4  46.99,21.59 90 top
C5  46.99,38.1 90 top
C6  46.99,63.5 90 top
C7  54.61,87.63 90 top
C8  52.07,101.6 90 top
C9  20.32,101.6 90 top
C10  20.32,87.63 90 top
C11  17.78,69.85 90 top
C12  19.05,55.88 90 top
C13  20.32,38.1 90 top
C14  139.7,105.41 90 top
C15  139.7,92.71 90 top
C16  139.7,80.01 90 top
C17  139.7,67.31 90 top
C18  20.32,21.59 90 top
C19  138.43,53.34 90 top
C20  138.43,39.37 90 top
C21  138.43,25.4 90 top
C22  138.43,12.7 90 top
C23  110.49,7.62 90 top
C24  109.22,105.41 90 top
IC1  110.49,81.28 0 top
IC2  110.49,58.42 0 top
IC3  33.02,21.59 0 top
IC4  67.31,87.63 0 top
IC5  63.5,63.5 0 top
IC6  33.02,87.63 0 top
IC7  66.04,101.6 0 top
IC8  63.5,38.1 0 top
IC9  63.5,21.59 0 top
IC10  33.02,101.6 0 top
IC11  31.75,71.12 0 top
IC12  33.02,55.88 0 top
IC13  110.49,30.48 0 top
IC14  33.02,38.1 0 top
IC15  151.13,53.34 0 top
IC18  119.38,105.41 0 top
IC26  154.94,105.41 0 top
IC27  154.94,92.71 0 top
IC28  154.94,80.01 0 top
IC29  154.94,67.16 0 top
JP1  7.62,109.22 0 top
PWR  173.99,3.81 180 top
R2  160.02,3.81 180 top
RN5  33.02,8.89 0 top
RN6  60.96,8.89 0 top
RN7  92.71,110.49 180 top
RN8  92.71,93.98 0 top
U$1  83.82,106.68 0 top
X1  2.54,57.15 180 top

### Tracks (layer width: path | path; a pad name or v marks a point on that pad's centre or on a via)
-BUS-EN
  Bottom 0.152: IC3.2 26.35,16.19 16.51,16.19 16.51,31.43 13.34,34.61 13.34,83.5 10.48,86.36 X1.C28 8.89,87.63 8.89,105.41 JP1.1
-HI-RAM  (via drill 0.25)
  Top 0.152: v37.47,87 37.78,86.68 52.39,86.68 56.83,82.23 88.27,82.23 90.49,84.45 v113.35,84.45 | IC15.2 137.48,58.1 v115.25,58.1
  Bottom 0.152: IC6.10 37.47,89.53 v37.47,87 | v113.35,84.45 115.25,82.55 115.25,66.99 IC2.20 114.3,59.05 v115.25,58.1
-LO-RAM  (via drill 0.25)
  Top 0.152: IC10.3 34.61,93.66 v67.94,93.66 | v80.33,88.58 81.6,87.31 112.71,87.31 IC1.20
  Bottom 0.152: v67.94,93.66 80.33,93.66 v80.33,88.58 | IC15.1 138.75,49.53 132.72,43.5 127.95,43.5 127.95,90.17 127.64,90.49 114.3,90.49 IC1.20
-MEM-RD  (via drill 0.25)
  Top 0.152: IC5.1 v43.5,59.69 41.91,61.28 15.56,61.28 12.06,64.77 8.89,64.77 v8.89,66.67
  Bottom 0.152: v43.5,59.69 36.51,66.67 36.51,82.87 IC6.5 | X1.B23 8.89,72.39 v8.89,66.67
-MEM-WR  (via drill 0.25)
  Top 0.152: v37.15,78.42 36.51,77.79 10.79,77.79 10.48,77.47 8.89,77.47 X1.B24
  Bottom 0.152: IC6.9 38.1,86.04 37.15,85.09 v37.15,78.42
-RESET  (via drill 0.25)
  Top 0.152: IC12.4 31.43,53.66 v23.81,53.66
  Bottom 0.152: v23.81,53.66 20.32,57.15 20.32,81.28 X1.C30
-ROM-CS  (via drill 0.25)
  Top 0.152: v31.43,79.69 89.85,79.69 91.12,78.42 v129.86,78.42 | IC13.20 120.33,44.13 v132.4,44.13
  Bottom 0.152: IC6.12 31.43,90.49 v31.43,79.69 | v129.86,78.42 138.43,69.85 138.43,64.77 142.56,60.64 | IC15.13 142.56,60.64 | v132.4,44.13 142.56,54.29 142.56,60.64
-TMP-REG-LD0  (via drill 0.25)
  Top 0.152: IC14.1 24.13,35.56 11.75,35.56 10.48,36.83 v6.03,36.83
  Bottom 0.152: v6.03,36.83 3.81,36.83 3.81,48.58 4.76,49.53 6.35,49.53 6.35,61.28 5.4,62.23 3.81,62.23 3.81,71.44 4.76,72.39 6.35,72.39 6.35,85.09 X1.B28
-TMP-REG-LD1  (via drill 0.25)
  Top 0.152: v26.99,45.72 25.72,46.99 4.76,46.99 2.54,49.21 2.54,90.17 6.35,90.17 X1.B30
  Bottom 0.152: IC14.13 26.99,42.86 v26.99,45.72
-TMP-REG-RD0
  Top 0.152: X1.B27 8.89,85.09 24.45,85.09 25.4,86.04 52.07,86.04 56.52,81.6 88.58,81.6 90.81,83.82 138.43,83.82 IC27.1
  Bottom 0.152: IC27.1 142.56,89.85 142.56,100.65 IC26.1
-TMP-REG-RD1  (via drill 0.25)
  Top 0.152: X1.B29 8.89,90.17 21.59,90.17 22.86,88.9 v39.69,88.9 | v44.13,75.88 143.19,75.88 IC28.1
  Bottom 0.152: IC28.1 142.56,75.25 142.56,64.45 143.51,63.5 IC29.1 | v39.69,88.9 44.13,84.45 v44.13,75.88
-VMA  (via drill 0.25)
  Top 0.152: IC3.1 28.57,20.95 v32.7,20.95 | v53.02,47.94 51.12,46.04 33.02,46.04 | 33.02,46.04 28.26,46.04 27.3,45.09 10.79,45.09 X1.C12 | 33.02,46.04 v33.02,45.09
  Bottom 0.152: v32.7,20.95 33.97,22.23 33.97,40.96 IC14.11 v33.02,45.09 | IC7.4 63.82,96.84 63.82,78.74 53.02,67.94 v53.02,47.94
ADDR0
  Top 0.152: IC8.2 52.07,31.75 4.76,31.75 3.81,30.8 3.81,22.86 X1.A3
ADDR1  (via drill 0.25)
  Top 0.152: IC8.4 56.52,31.11 v15.88,31.11 | v13.34,26.04 11.43,24.13 6.35,24.13 X1.A4
  Bottom 0.152: v15.88,31.11 13.34,28.57 v13.34,26.04
ADDR2  (via drill 0.25)
  Top 0.152: IC8.6 60.96,30.48 v12.06,30.48
  Bottom 0.152: v12.06,30.48 12.06,28.26 10.48,26.67 5.08,26.67 X1.A5
ADDR3  (via drill 0.25)
  Top 0.152: IC8.8 65.41,29.84 v11.43,29.84
  Bottom 0.152: v11.43,29.84 10.79,29.21 5.71,29.21 5.71,29.84 X1.A6
ADDR4  (via drill 0.25)
  Top 0.152: v72.07,36.51 48.58,36.51 44.77,32.7 12.06,32.7 10.48,34.29 6.35,34.29 X1.A7
  Bottom 0.152: IC8.11 72.07,39.05 v72.07,36.51
ADDR5
  Bottom 0.152: IC8.13 69.53,41.59 69.53,36.2 68.26,34.92 68.26,15.88 61.91,9.53 61.91,7.62 59.69,5.4 6.35,5.4 6.35,14.92 3.81,17.46 3.81,29.21 3.17,29.84 3.17,32.7 5.08,34.61 X1.A8
ADDR6  (via drill 0.25)
  Top 0.152: v63.82,39.05 62.55,37.78 50.48,37.78 47.62,40.64 41.59,40.64 40.64,39.69 21.91,39.69 20.95,40.64 11.75,40.64 10.48,39.37 6.35,39.37 X1.A9
  Bottom 0.152: IC8.15 63.82,40.96 v63.82,39.05
ADDR7
  Top 0.152: IC8.17 58.1,43.5 12.06,43.5 10.48,41.91 6.35,41.91 X1.A10
ADDR8  (via drill 0.25)
  Top 0.152: v48.9,10.16 45.4,6.67 11.43,6.67 2.86,15.24 0.95,15.24 0.64,15.56 0.64,43.18 X1.A11
  Bottom 0.152: IC9.2 48.9,12.06 v48.9,10.16
ADDR9
  Bottom 0.152: IC9.4 61.28,16.19 63.82,16.19 63.82,19.05 64.14,19.37 65.72,19.37 65.72,15.88 59.37,9.53 59.37,7.62 57.78,6.03 12.7,6.03 12.7,42.23 10.48,44.45 5.08,44.45 X1.A12
ADDR10  (via drill 0.25)
  Top 0.152: v15.88,47.62 14.92,48.58 11.43,48.58 10.48,49.53 6.35,49.53 X1.A13
  Bottom 0.152: IC9.6 64.45,17.46 64.45,15.88 61.91,13.34 56.83,13.34 56.83,7.62 55.88,6.67 26.99,6.67 26.99,14.61 28.89,16.51 28.89,19.05 24.77,23.18 22.86,23.18 22.86,40.64 v15.88,47.62
ADDR11  (via drill 0.25)
  Top 0.152: IC9.8 69.85,20 70.17,20.32 70.17,21.27 49.85,21.27 46.99,18.41 42.23,18.41 39.05,21.59 4.13,21.59 3.17,22.54 v3.17,33.66
  Bottom 0.152: v3.17,33.66 3.17,48.9 X1.A14
ADDR12  (via drill 0.25)
  Top 0.152: IC9.11 73.34,23.81 47.94,23.81 44.45,27.3 v22.23,27.3 | v15.24,49.85 10.48,54.61 6.35,54.61 X1.A15
  Bottom 0.152: v22.23,27.3 15.24,34.29 v15.24,49.85
ADDR13  (via drill 0.25)
  Top 0.152: v69.53,20.64 68.26,19.37 48.9,19.37 45.72,16.19 13.34,16.19 10.48,19.05 v3.17,19.05
  Bottom 0.152: IC9.13 69.53,25.08 v69.53,20.64 | v3.17,19.05 2.54,19.68 2.54,53.34 X1.A16
ADDR14  (via drill 0.25)
  Top 0.152: v61.28,55.24 59.05,57.47 22.23,57.47 20,59.69 6.35,59.69 X1.A17
  Bottom 0.152: IC9.15 61.28,28.89 v61.28,55.24
ADDR15  (via drill 0.25)
  Top 0.152: IC9.17 57.15,27.94 v50.8,27.94 v23.81,27.94 | v13.97,60.33 12.06,62.23 6.35,62.23 X1.A18 | IC10.4 36.51,94.3 v50.16,94.3
  Bottom 0.152: v23.81,27.94 23.5,28.26 23.5,48.26 13.97,57.78 v13.97,60.33 | v50.16,94.3 50.16,52.7 50.8,52.07 v50.8,27.94
BADDR0  (via drill 0.25)
  Top 0.152: IC8.18 58.74,40.32 60.33,40.32 61.28,41.27 61.28,43.5 83.5,43.5 84.77,42.23 v113.98,42.23
  Bottom 0.152: 115.25,43.5 116.84,45.09 IC2.10 115.89,51.75 115.89,72.71 IC1.10 | 115.25,43.5 v113.98,42.23 | IC13.10 115.25,24.45 115.25,43.5
BADDR1
  Top 0.152: IC8.16 63.82,40.32 111.76,40.32 113.35,38.73 113.35,22.86 IC13.9
  Bottom 0.152: IC1.9 113.35,72.71 113.35,51.75 IC2.9 113.35,49.85 113.35,23.81 IC13.9
BADDR2  (via drill 0.25)
  Top 0.152: v68.26,46.67 70.17,48.58 109.54,48.58 IC2.8
  Bottom 0.152: IC8.14 68.26,42.86 v68.26,46.67 | IC13.8 110.81,23.81 110.81,49.85 | IC2.8 110.81,49.85 | IC1.8 110.81,72.71 110.81,49.85
BADDR3
  Bottom 0.152: IC1.7 108.27,72.71 108.27,51.75 IC2.7 108.27,49.85 108.27,20.64 | IC8.12 71.44,40.96 71.44,24.13 74.93,20.64 108.27,20.64 | 108.27,20.64 109.22,20.64 IC13.7
BADDR4  (via drill 0.25)
  Top 0.152: v80.01,26.67 82.23,24.45 105.09,24.45 IC13.6
  Bottom 0.152: IC1.6 105.73,72.71 105.73,51.75 IC2.6 105.73,49.85 105.73,23.81 IC13.6 | v80.01,26.67 IC8.9
BADDR5  (via drill 0.25)
  Top 0.152: v77.47,52.39 78.11,53.02 101.92,53.02 IC2.5
  Bottom 0.152: IC8.7 67.63,34.61 67.63,40.01 68.9,41.27 68.9,43.81 v77.47,52.39 | IC13.5 103.19,23.81 103.19,49.85 | IC2.5 103.19,49.85 | IC1.5 103.19,72.71 103.19,49.85
BADDR6  (via drill 0.25)
  Top 0.152: v63.18,46.67 65.72,49.21 100.01,49.21 IC2.4
  Bottom 0.152: IC8.5 63.18,35.24 v63.18,46.67 | IC13.4 100.65,23.81 100.65,49.85 | IC2.4 100.65,49.85 | IC1.4 100.65,72.71 100.65,49.85
BADDR7  (via drill 0.25)
  Top 0.152: IC8.3 58.74,35.88 v96.2,35.88
  Bottom 0.152: 98.11,33.97 99.06,33.02 IC13.3 | 98.11,33.97 v96.2,35.88 | 98.11,49.85 IC2.3 | 98.11,33.97 98.11,49.85 | IC1.3 98.11,72.71 98.11,49.85
BADDR8  (via drill 0.25)
  Top 0.152: v58.74,38.42 60.01,39.69 100.01,39.69 IC13.25
  Bottom 0.152: IC1.25 102.55,87.95 102.55,66.99 IC2.25 102.55,65.09 102.55,39.05 IC13.25 | IC9.18 58.74,26.99 v58.74,38.42
BADDR9
  Top 0.152: IC9.16 64.77,27.94 93.98,27.94 IC13.24
  Bottom 0.152: IC1.24 105.09,87.95 105.09,66.99 IC2.24 105.09,65.09 105.09,39.05 IC13.24
BADDR10
  Top 0.152: IC9.14 69.22,27.3 100.97,27.3 IC13.21
  Bottom 0.152: IC1.21 112.71,87.95 112.71,66.99 IC2.21 112.71,65.09 112.71,39.05 IC13.21
BADDR11
  Bottom 0.152: IC1.23 107.63,87.95 107.63,66.99 IC2.23 107.63,65.09 107.63,37.15 | IC9.12 76.52,21.27 107.63,21.27 107.63,37.15 | IC13.23 107.63,37.15
BADDR12  (via drill 0.25)
  Top 0.152: IC11.4 32.7,65.09 45.4,65.09 48.58,68.26 v48.9,68.26 | IC2.2 94.93,52.39 78.42,52.39 77.79,51.75 v50.16,51.75
  Bottom 0.152: IC13.2 95.57,23.81 95.57,49.85 | IC2.2 95.57,49.85 | IC1.2 95.57,72.71 95.57,49.85 | IC7.1 52.7,97.79 49.53,94.61 49.53,68.9 v48.9,68.26 48.9,53.02 v50.16,51.75
BADDR13  (via drill 0.25)
  Top 0.152: IC11.7 42.86,72.07 v50.8,72.07 | v98.74,97.16 97.47,98.42 76.52,98.42 75.56,99.38 69.22,99.38 68.26,98.42 68.26,96.2 61.28,96.2 IC7.2
  Bottom 0.152: IC2.26 100.01,66.99 100.01,87.95 IC1.26 98.42,89.53 98.42,92.39 98.74,92.71 v98.74,97.16 | v50.8,72.07 58.74,80.01 58.74,96.84 IC7.2
BADDR14
  Top 0.152: IC1.1 93.66,73.34 58.42,73.34 56.83,74.93 IC11.9
  Bottom 0.152: IC2.1 93.03,51.75 93.03,72.71 IC1.1 | IC11.9 39.05,76.52 39.05,92.08 48.58,101.6 62.23,101.6 IC7.3
BADDR15  (via drill 0.25)
  Top 0.152: v65.72,77.15 65.09,76.52 34.61,76.52 IC11.12
  Bottom 0.152: IC14.3 31.43,35.24 31.43,48.58 33.34,50.48 33.97,50.48 33.97,73.98 IC11.12 | IC7.6 65.72,93.66 v65.72,77.15
BDATA0  (via drill 0.25)
  Top 0.152: v58.74,56.83 61.28,54.29 115.89,54.29 IC2.11
  Bottom 0.152: IC5.18 58.74,65.72 v58.74,56.83 | IC13.11 118.43,23.81 118.43,49.85 | IC2.11 118.43,49.85 | IC1.11 118.43,72.71 118.43,49.85
BDATA1  (via drill 0.25)
  Top 0.152: v60.01,73.98 61.28,75.25 120.33,75.25 IC1.12
  Bottom 0.152: IC13.12 120.97,23.81 120.97,49.85 IC2.12 120.97,51.75 120.97,72.71 IC1.12 | IC5.17 60.01,67.63 v60.01,73.98
BDATA2  (via drill 0.25)
  Top 0.152: v63.18,70.17 65.09,72.07 122.87,72.07 IC1.13
  Bottom 0.152: IC13.13 123.51,23.81 123.51,49.85 IC2.13 123.51,51.75 123.51,72.71 IC1.13 | IC5.16 63.18,68.26 v63.18,70.17
BDATA3  (via drill 0.25)
  Top 0.152: v65.72,70.17 125.73,70.17 127,68.9 IC2.15
  Bottom 0.152: IC13.15 126.05,39.05 126.05,65.09 | IC2.15 126.05,65.09 | IC5.15 65.72,68.26 v65.72,70.17 | IC1.15 126.05,87.95 126.05,65.09
BDATA4
  Top 0.152: IC5.14 70.8,63.82 122.24,63.82 IC2.16
  Bottom 0.152: IC13.16 125.41,39.05 125.41,65.09 | IC2.16 125.41,65.09 | IC1.16 125.41,87.95 125.41,65.09
BDATA5
  Top 0.152: IC5.13 71.44,68.9 119.06,68.9 IC2.17
  Bottom 0.152: IC13.17 122.87,39.05 122.87,65.09 | IC2.17 122.87,65.09 | IC1.17 122.87,87.95 122.87,65.09
BDATA6
  Top 0.152: IC5.12 75.25,64.45 117.79,64.45 IC2.18
  Bottom 0.152: IC13.18 120.33,39.05 120.33,65.09 | IC2.18 120.33,65.09 | IC1.18 120.33,87.95 120.33,65.09
BDATA7
  Top 0.152: IC5.11 75.25,67.63 115.25,67.63 IC2.19
  Bottom 0.152: IC13.19 117.79,39.05 117.79,65.09 | IC2.19 117.79,65.09 | IC1.19 117.79,87.95 117.79,65.09
DATA0  (via drill 0.25)
  Top 0.152: IC28.3 IC28.2 | IC26.3 IC26.2 | 26.99,10.48 30.48,13.97 v48.9,13.97 | 26.99,10.48 RN5.2 | v8.89,46.35 8.89,44.45 7.3,44.45 6.35,43.5 6.35,42.55 6.03,42.55 5.4,41.91 4.76,41.91 1.27,38.42 1.27,15.88 3.49,15.88 8.89,10.48 26.99,10.48 | v145.1,69.53 138.75,63.18 v55.56,63.18
  Bottom 0.152: IC26.2 145.1,100.65 145.1,77.15 IC28.2 145.1,75.25 v145.1,69.53 | v48.9,13.97 51.12,16.19 51.12,27.3 53.66,29.84 53.66,58.74 IC5.2 54.61,62.23 v55.56,63.18 | X1.A19 6.35,62.23 8.89,62.23 v8.89,46.35
DATA1  (via drill 0.25)
  Top 0.152: IC28.5 IC28.4 149.54,74.61 130.18,74.61 126.36,70.8 64.77,70.8 63.5,69.53 v53.66,69.53 | IC26.5 IC26.4 | 33.66,49.85 34.29,50.48 45.09,50.48 49.85,55.24 v51.12,55.24 v56.83,55.24 | 33.66,49.85 v32.07,48.26 | v11.43,57.15 18.73,49.85 33.66,49.85
  Bottom 0.152: IC28.4 150.18,77.15 150.18,100.65 IC26.4 | RN5.3 32.07,13.02 v32.07,48.26 | v56.83,55.24 57.15,55.56 IC5.3 | X1.A20 6.35,64.77 11.43,64.77 v11.43,57.15 | v53.66,69.53 51.12,69.53 v51.12,55.24
DATA2  (via drill 0.25)
  Top 0.152: IC28.6 IC28.7 160.34,77.79 164.47,77.79 165.42,76.83 165.42,55.56 140.97,55.56 137.79,58.74 96.52,58.74 93.66,55.88 63.5,55.88 IC5.4 58.1,58.1 53.02,58.1 | IC26.7 IC26.6 | 53.02,58.1 v43.5,58.1 | X1.A21 6.35,67.31 15.24,67.31 20.64,61.91 45.4,61.91 46.35,60.96 51.12,60.96 51.44,61.28 52.7,61.28 53.02,60.96 53.02,58.1
  Bottom 0.152: IC28.6 157.16,77.15 157.16,100.65 IC26.6 | RN5.4 32.07,7.3 39.69,7.3 39.69,38.73 43.5,42.55 v43.5,58.1
DATA3  (via drill 0.25)
  Top 0.152: IC28.9 IC28.8 | IC26.9 IC26.8 157.8,98.11 109.22,98.11 102.87,91.76 v79.69,91.76 | IC5.5 60.64,61.28 54.93,61.28 52.7,63.5 35.56,63.5 v34.61,62.55 20.95,62.55 13.65,69.85 6.35,69.85 X1.A22
  Bottom 0.152: IC28.8 160.34,77.15 160.34,100.65 IC26.8 | RN5.5 34.61,10.48 v34.61,62.55 | v79.69,91.76 75.56,87.63 66.36,87.63 66.36,65.41 62.23,61.28 IC5.5
DATA4  (via drill 0.25)
  Top 0.152: IC28.12 IC28.13 154.62,77.15 154.62,61.28 66.36,61.28 IC5.6 | IC26.12 IC26.13 | v61.91,48.58 38.42,48.58 v36.51,46.67 32.7,46.67 30.16,49.21 14.92,49.21 12.06,52.07 3.17,52.07 v3.17,71.75
  Bottom 0.152: IC28.12 164.78,84.77 164.78,108.27 IC26.12 | RN5.6 36.51,9.84 v36.51,46.67 | v61.91,48.58 64.77,51.44 IC5.6 | v3.17,71.75 X1.A23
DATA5  (via drill 0.25)
  Top 0.152: IC28.14 IC28.15 150.18,77.79 140.65,77.79 139.38,76.52 v88.27,76.52 | IC26.14 IC26.15 | v37.15,64.14 36.83,64.45 20,64.45 11.43,73.03 11.43,74.93 6.35,74.93 X1.A24 | v42.86,45.4 v66.36,45.4
  Bottom 0.152: IC28.14 159.7,84.77 159.7,108.27 IC26.14 | RN5.7 37.15,9.84 37.15,45.4 | v37.15,64.14 37.15,45.4 | v66.36,45.4 66.36,58.74 IC5.7 67.31,61.91 73.66,61.91 v88.27,76.52 | 37.15,45.4 v42.86,45.4
DATA6  (via drill 0.25)
  Top 0.152: IC28.16 IC28.17 147.32,80.01 v93.34,80.01 | IC26.16 IC26.17 | v44.77,49.21 48.58,53.02 v66.99,53.02 | X1.A25 6.35,80.01 30.16,80.01 31.11,79.06 v39.69,79.06
  Bottom 0.152: IC28.16 154.62,84.77 154.62,108.27 IC26.16 | RN5.8 44.77,13.02 v44.77,49.21 44.77,73.98 v39.69,79.06 | v66.99,53.02 69.85,55.88 IC5.8 69.85,61.28 74.61,61.28 v93.34,80.01
DATA7  (via drill 0.25)
  Top 0.152: IC28.18 IC28.19 144.46,82.23 140.65,82.23 140.34,82.55 v96.84,82.55 | IC26.18 IC26.19 | RN5.9 46.35,12.06 v69.53,12.06 | X1.A26 3.81,80.01 3.81,57.15 10.48,57.15 11.11,57.78 16.51,57.78 18.41,55.88 58.74,55.88 60.96,53.66 v69.53,53.66
  Bottom 0.152: IC28.18 147.64,84.77 147.64,108.27 IC26.18 | v69.53,12.06 70.8,13.34 70.8,44.77 78.11,52.07 78.11,53.98 75.88,56.2 | IC5.9 73.98,58.1 | 73.98,58.1 75.88,56.2 | 73.98,58.1 v69.53,53.66 | v96.84,82.55 75.88,61.59 75.88,56.2
DATA8  (via drill 0.25)
  Top 0.152: IC29.2 146.05,63.5 148.59,63.5 IC29.3 | IC27.3 IC27.2 140.34,83.19 93.98,83.19 92.08,81.28 89.22,81.28 88.27,80.33 v48.9,80.33 46.99,82.23 10.79,82.23 10.48,82.55 6.35,82.55 X1.A27
  Bottom 0.152: IC27.3 149.54,87.95 149.54,64.45 148.59,63.5 IC29.3 | RN6.2 51.75,7.3 48.26,7.3 48.26,68.58 48.9,69.22 v48.9,80.33
DATA9  (via drill 0.25)
  Top 0.152: IC29.4 151.13,63.5 153.67,63.5 IC29.5 | IC27.5 IC27.4 147.32,92.71 104.78,92.71 102.55,90.49 76.2,90.49 75.56,89.85 57.47,89.85 55.24,87.63 6.35,87.63 X1.A28 | v52.07,12.7 50.16,14.61 v5.71,14.61
  Bottom 0.152: IC27.4 152.08,87.95 152.08,69.85 151.45,69.22 151.45,63.82 151.13,63.5 IC29.4 | v52.07,12.7 RN6.3 | v5.71,14.61 1.91,18.41 1.91,83.19 X1.A28
DATA10  (via drill 0.25)
  Top 0.152: IC27.7 IC27.6 | v122.56,13.34 59.37,13.34 v58.74,12.7 56.2,15.24 13.34,15.24 12.06,16.51 2.86,16.51 v1.91,17.46 | IC29.7 158.75,63.5 156.21,63.5 IC29.6
  Bottom 0.152: RN6.4 58.74,9.21 v58.74,12.7 | v122.56,13.34 155.26,46.04 155.26,62.23 156.21,63.18 IC29.6 | X1.A29 1.27,85.09 1.27,18.1 v1.91,17.46 | IC27.7 157.8,87.95 157.8,64.45 158.75,63.5 IC29.7
DATA11  (via drill 0.25)
  Top 0.152: v129.86,12.7 v64.14,12.7 | IC29.9 163.83,63.5 161.29,63.5 IC29.8 | IC27.8 IC27.9 164.78,88.9 164.78,102.87 164.47,103.19 147.32,103.19 137.79,112.71 6.35,112.71 6.35,92.71 X1.A30
  Bottom 0.152: RN6.5 61.28,9.21 61.28,9.84 v64.14,12.7 | v129.86,12.7 161.29,44.13 IC29.8 | IC27.9 162.88,87.95 162.88,64.45 163.83,63.5 IC29.9
DATA12  (via drill 0.25)
  Top 0.152: IC29.13 161.29,71.12 163.83,71.12 IC29.12 | IC27.12 IC27.13 | RN6.6 60.64,6.03 v12.06,6.03
  Bottom 0.152: IC27.13 162.24,95.57 162.24,72.07 161.29,71.12 IC29.13 161.29,70.8 159.7,69.22 159.7,43.5 120.65,4.45 63.5,4.45 RN6.6 | v12.06,6.03 8.89,9.21 8.89,21.59 X1.B3
DATA13  (via drill 0.25)
  Top 0.152: IC29.15 156.21,71.12 158.75,71.12 IC29.14 | IC27.14 IC27.15 | RN6.7 64.14,10.79 47.31,10.79 43.81,7.3 v12.06,7.3
  Bottom 0.152: IC27.15 155.26,95.57 155.26,72.07 156.21,71.12 IC29.15 156.21,70.8 152.72,67.31 152.72,44.45 113.35,5.08 66.04,5.08 RN6.7 | v12.06,7.3 11.43,7.94 11.43,23.18 10.48,24.13 7.62,24.13 X1.B4
DATA14  (via drill 0.25)
  Top 0.152: IC29.17 151.13,71.12 153.67,71.12 IC29.16 | IC27.16 IC27.17 | RN6.8 66.04,11.43 v47.62,11.43 | v45.4,19.05 41.27,23.18 21.91,23.18 18.41,26.67 8.89,26.67 X1.B5
  Bottom 0.152: IC27.16 152.72,95.57 152.72,72.07 153.67,71.12 IC29.16 153.67,70.8 152.72,69.85 152.72,68.26 152.08,67.63 152.08,44.77 114.94,7.62 72.07,7.62 71.75,7.3 68.58,7.3 RN6.8 | v47.62,11.43 45.4,13.65 v45.4,19.05
DATA15  (via drill 0.25)
  Top 0.152: IC29.19 146.05,71.12 148.59,71.12 IC29.18 | IC27.18 IC27.19 | v68.9,28.57 68.26,29.21 8.89,29.21 X1.B6
  Bottom 0.152: IC27.19 147,95.57 147,72.07 146.05,71.12 IC29.19 146.05,70.8 147,69.85 147,40.64 116.52,10.16 69.85,10.16 | 69.85,10.16 68.9,11.11 v68.9,28.57 | 69.85,10.16 RN6.9
FORCE-ROM  (via drill 0.25)
  Top 0.152: IC12.5 33.02,54.61 v23.81,54.61
  Bottom 0.152: v23.81,54.61 22.86,55.56 IC11.1
GND
  pour Route2: 6.34,8.92 6.32,8.9 6.29,8.89 0,8.89 0,0 176.53,0 176.53,113.03 0,113.03 0,105.41 6.29,105.41 6.32,105.4 6.34,105.38 6.35,105.35 6.35,97.85 6.34,97.82 6.32,97.8 6.29,97.79 0,97.79 0,16.51 6.29,16.51 6.32,16.5 6.34,16.48 6.35,16.45 6.35,8.95
MEM-RD
  Top 0.152: IC6.1 26.99,85.41 36.51,85.41 IC6.6
N$1
  Bottom 0.152: IC6.13 28.26,91.76 28.26,95.89 28.89,96.52 28.89,106.05 36.2,113.35 127,113.35 IC18.8
N$2  (via drill 0.25)
  Top 0.152: v30.8,88.27 40.96,88.27 41.27,88.58 41.27,91.44 IC6.8
  Bottom 0.152: IC6.3 30.8,84.14 v30.8,88.27
N$3  (via drill 0.25)
  Top 0.152: v28.89,93.03 28.89,99.38 51.12,99.38 56.2,94.3 76.2,94.3 79.38,91.12 v99.06,91.12
  Bottom 0.152: IC13.22 110.17,39.05 110.17,65.09 IC2.22 110.17,66.99 110.17,87.95 IC1.22 109.22,91.12 v99.06,91.12 | IC6.2 28.89,84.77 v28.89,93.03
N$4  (via drill 0.25)
  Top 0.152: v35.88,77.15 64.77,77.15 65.41,77.79 v93.03,77.79
  Bottom 0.152: IC13.27 97.47,39.05 97.47,65.09 IC2.27 97.47,66.99 97.47,82.23 | IC6.4 35.88,80.96 v35.88,77.15 | 97.47,82.23 v93.03,77.79 | 97.47,82.23 97.47,87.95 IC1.27
N$11
  Top 0.152: R2.1 166.05,4.76 174.31,4.76 PWR.A
N$12  (via drill 0.25)
  Top 0.152: IC14.10 33.97,40.32 v28.89,40.32
  Bottom 0.152: v28.89,40.32 28.89,80.64 26.99,82.55 26.99,96.84 IC10.2
N$13  (via drill 0.25)
  Top 0.152: IC14.4 29.84,37.47 v28.89,37.47
  Bottom 0.152: v28.89,37.47 26.35,40.01 26.35,96.84 IC10.1
N$14
  Top 0.152: IC6.11 34.61,93.03 73.34,93.03 IC4.8
N$15  (via drill 0.25)
  Top 0.152: IC9.9 72.39,21.91 47.94,21.91 47.62,21.59 43.81,21.59 41.59,23.81 v26.99,23.81
  Bottom 0.152: v26.99,23.81 24.45,23.81 24.45,66.36 IC11.2
N$16  (via drill 0.25)
  Top 0.152: v65.72,63.82 65.72,68.9 44.45,68.9 41.27,65.72 34.61,65.72 IC11.5
  Bottom 0.152: IC9.7 66.36,18.73 66.36,44.45 65.72,45.09 v65.72,63.82
N$17  (via drill 0.25)
  Top 0.152: v60.64,70.17 57.47,73.34 37.15,73.34 IC11.11
  Bottom 0.152: IC9.5 60.64,19.37 v60.64,70.17
N$18  (via drill 0.25)
  Top 0.152: v56.2,70.17 53.66,72.71 30.16,72.71 IC11.14
  Bottom 0.152: IC9.3 56.2,18.73 v56.2,70.17
N$19
  Bottom 0.152: IC12.3 32.07,53.66 32.07,88.27 34.61,90.81 34.61,92.71 38.1,96.2 39.69,96.2 39.69,104.46 IC10.8
N$20
  Top 0.152: IC10.9 IC10.10
  Bottom 0.152: IC10.9 IC10.6
N$21
  Top 0.152: IC5.19 54.61,62.55 61.59,62.55 63.82,60.33 63.82,58.1 90.49,58.1 90.81,58.42 95.25,58.42 96.2,59.37 146.37,59.37 IC15.12
N$22
  Bottom 0.152: IC10.5 33.02,100.33 IC10.11
N$24
  Top 0.152: IC7.5 63.5,101.6 15.24,101.6 JP1.2
N$25
  Top 0.152: IC10.12 IC10.13
  Bottom 0.152: IC3.3 29.53,18.73 29.53,104.46 IC10.12
N$33  (via drill 0.25)
  Top 0.152: IC14.2 27.94,38.1 49.21,38.1 50.16,37.15 v72.71,37.15 | v85.09,42.86 87,44.77 157.16,44.77 167.96,55.56 167.96,96.52 IC27.11
  Bottom 0.152: v72.71,37.15 85.09,37.15 v85.09,42.86 | IC26.11 165.42,108.27 165.42,97.47 IC27.11
N$47  (via drill 0.25)
  Top 0.152: v30.8,44.13 31.11,44.45 85.72,44.45 86.68,45.4 156.84,45.4 167.32,55.88 167.32,70.8 166.37,70.8 IC29.11
  Bottom 0.152: IC14.12 30.8,42.23 v30.8,44.13 | IC28.11 165.42,82.87 165.42,72.07 166.37,71.12 IC29.11
RAM0
  Bottom 0.152: IC4.1 63.18,87.31 63.18,98.42 64.45,99.69 85.09,99.69 | 85.09,99.69 RN8.2 | 85.09,99.69 U$1.17
RAM1  (via drill 0.25)
  Top 0.152: IC4.2 67.63,89.22 v80.96,89.22
  Bottom 0.152: v80.96,89.22 87.63,89.22 RN8.3 U$1.18
RAM2  (via drill 0.25)
  Top 0.152: IC4.3 68.9,87.95 v76.83,87.95
  Bottom 0.152: v76.83,87.95 90.17,87.95 RN8.4 U$1.19
RAM3
  Bottom 0.152: IC4.4 70.48,87 92.71,87 RN8.5 U$1.20
RAM4
  Bottom 0.152: IC4.5 72.39,86.36 94.93,86.36 94.93,93.66 RN8.6 U$1.21
RAM5
  Bottom 0.152: IC4.6 74.3,85.72 95.57,85.72 95.57,91.76 RN8.7 U$1.22
RAM6  (via drill 0.25)
  Top 0.152: v78.42,93.03 79.06,92.39 98.74,92.39 RN8.8
  Bottom 0.152: IC4.11 68.9,93.03 v78.42,93.03 | RN8.8 U$1.23
RAM7  (via drill 0.25)
  Top 0.152: v65.09,94.93 65.72,95.57 101.28,95.57 | RN8.9 101.28,95.57 | U$1.24 102.87,95.57 101.28,95.57
  Bottom 0.152: IC4.12 65.09,91.76 v65.09,94.93
ROM0
  Top 0.152: IC18.12 115.25,107.63 110.17,107.63 108.9,108.9 84.14,108.9 RN7.9
  Bottom 0.152: RN7.9 85.09,107.95 U$1.1
ROM1
  Bottom 0.152: U$1.2 87.63,107.95 RN7.8 85.09,112.71 115.89,112.71 IC18.11
ROM2
  Top 0.152: IC18.6 117.79,108.27 117.79,112.08 89.22,112.08 RN7.7
  Bottom 0.152: RN7.7 90.17,107.95 U$1.3
ROM3
  Bottom 0.152: U$1.4 92.71,107.95 RN7.6 90.17,112.08 103.5,112.08 104.14,111.44 104.14,105.41 118.11,105.41 IC18.5
ROM4
  Top 0.152: IC18.4 115.57,105.41 104.46,105.41 103.19,104.14 96.52,104.14 U$1.5
  Bottom 0.152: RN7.5 94.93,108.27 94.93,105.73 U$1.5
ROM5  (via drill 0.25)
  Top 0.152: U$1.6 v96.2,107
  Bottom 0.152: RN7.4 96.2,109.54 v96.2,107 | IC18.3 114.3,99.06 101.6,99.06 101.6,100.65 100.65,101.6 99.06,101.6 99.06,104.14 U$1.6
ROM6
  Bottom 0.152: RN7.3 100.33,107.95 U$1.7 101.6,104.14 101.6,101.6 103.19,101.6 104.14,100.65 104.14,100.01 112.71,100.01 IC18.2
ROM7
  Bottom 0.152: RN7.2 102.87,107.95 U$1.8 104.14,104.14 104.14,101.6 IC18.1
SEL0
  Bottom 0.152: IC7.15 61.28,107 82.55,107 82.55,105.09 84.77,102.87 U$1.9
SEL1
  Top 0.152: IC7.14 66.04,101.6 86.36,101.6 U$1.10
SEL2
  Top 0.152: IC7.13 66.36,103.82 84.45,103.82 84.77,104.14 88.9,104.14 U$1.11
SEL3
  Bottom 0.152: IC7.12 72.39,100.33 83.82,100.33 83.82,100.65 84.77,101.6 92.71,101.6 U$1.12
SEL4
  Top 0.152: IC7.11 71.44,107 92.71,107 93.98,105.73 93.98,102.87 U$1.13
SEL5  (via drill 0.25)
  Top 0.152: v76.83,100.97 78.74,99.06 95.57,99.06 96.52,100.01 96.52,102.87 U$1.14
  Bottom 0.152: v76.83,100.97 IC7.10
SEL6  (via drill 0.25)
  Top 0.152: v83.19,105.41 IC7.9
  Bottom 0.152: v83.19,105.41 84.45,104.14 96.52,104.14 96.52,105.73 97.47,106.68 99.06,106.68 99.06,105.09 100.33,103.82 U$1.15
SEL7
  Top 0.152: IC7.7 73.98,96.2 98.74,96.2 101.6,99.06 101.6,102.87 U$1.16
VCC
  pour Route15: 6.34,8.92 6.32,8.9 6.29,8.89 0,8.89 0,0 176.53,0 176.53,113.03 0,113.03 0,105.41 6.29,105.41 6.32,105.4 6.34,105.38 6.35,105.35 6.35,97.85 6.34,97.82 6.32,97.8 6.29,97.79 0,97.79 0,16.51 6.29,16.51 6.32,16.5 6.34,16.48 6.35,16.45 6.35,8.95

### Text on the board
tNames: -BUS-EN | Gnd | YACC1 MEMORY BOARD V1.3 | ROM | 0XF000 | 0X8000 | RAM | 0 | onepagecomputer.com